# EAGLE design BaseStationV1 (EAGLE 5.07)
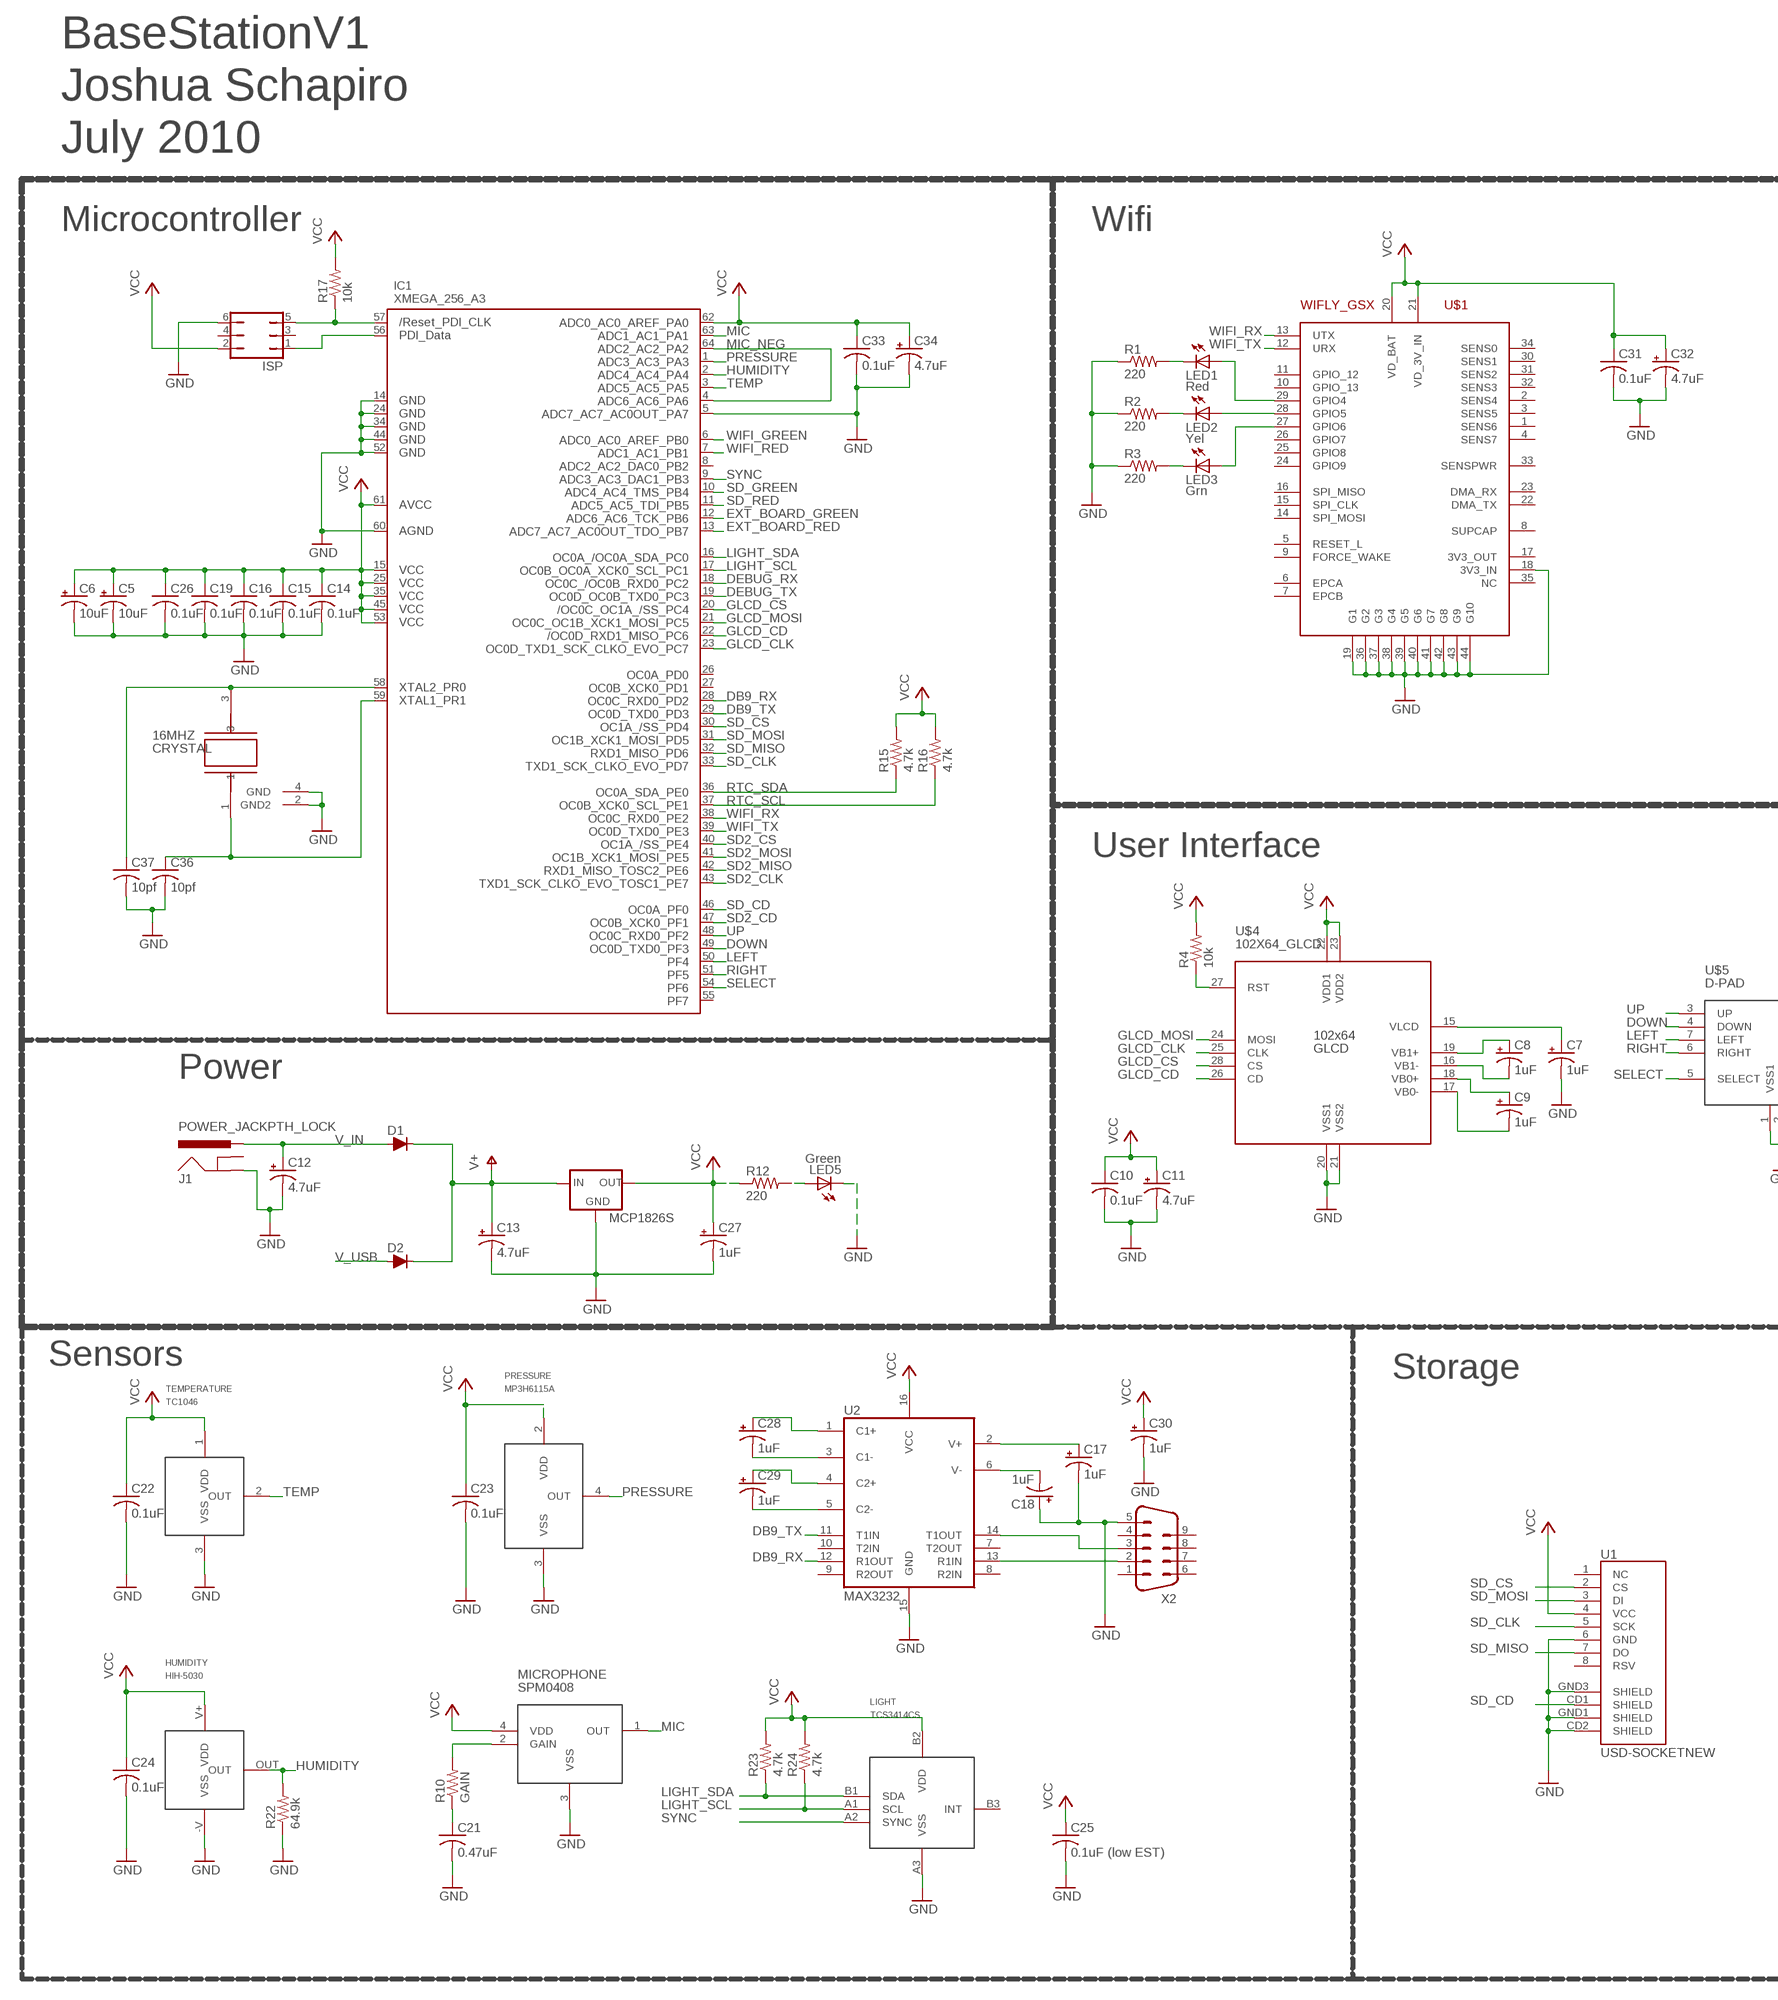
[diagram p0: schematic, sheet 1, part 1 of 2]
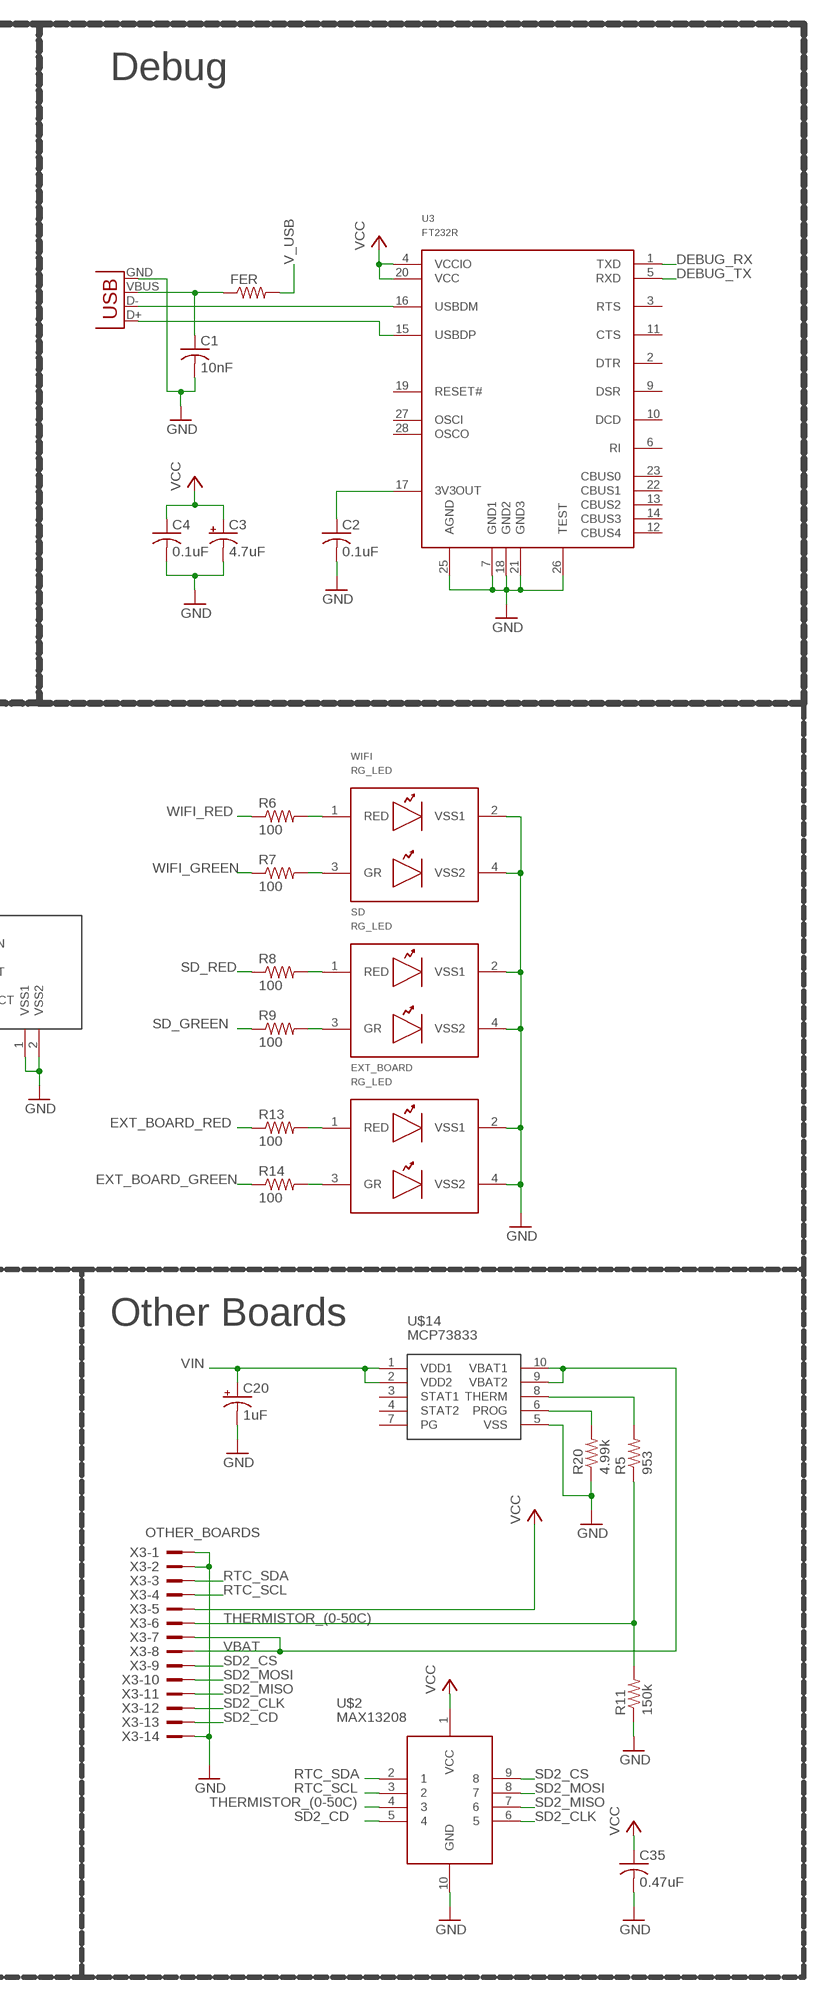
[diagram p1: schematic, sheet 1, part 2 of 2]

## Parts
16MHZ  CRYSTAL  [3.2X2.5MMCRYSTAL]
C1  10nF  C-USC1206  [C1206]
C2  0.1uF  C-USC1206  [C1206]
C3  4.7uF  CPOL-USB  [PANASONIC_B]
C4  0.1uF  C-USC1206  [C1206]
C5  10uF  CPOL-USB  [PANASONIC_B]
C6  10uF  CPOL-USB  [PANASONIC_B]
C7  1uF  CPOL-USB  [PANASONIC_B]
C8  1uF  CPOL-USB  [PANASONIC_B]
C9  1uF  CPOL-USB  [PANASONIC_B]
C10  0.1uF  C-USC1206  [C1206]
C11  4.7uF  CPOL-USB  [PANASONIC_B]
C12  4.7uF  CPOL-USB  [PANASONIC_B]
C13  4.7uF  CPOL-USB  [PANASONIC_B]
C14  0.1uF  C-USC1206  [C1206]
C15  0.1uF  C-USC1206  [C1206]
C16  0.1uF  C-USC1206  [C1206]
C17  1uF  CPOL-USB  [PANASONIC_B]
C18  1uF  CPOL-USB  [PANASONIC_B]
C19  0.1uF  C-USC1206  [C1206]
C20  1uF  CPOL-USB  [PANASONIC_B]
C21  0.47uF  C-USC1206  [C1206]
C22  0.1uF  C-USC1206  [C1206]
C23  0.1uF  C-USC1206  [C1206]
C24  0.1uF  C-USC1206  [C1206]
C25  0.1uF (low EST)  C-USC1206  [C1206]
C26  0.1uF  C-USC1206  [C1206]
C27  1uF  CPOL-USB  [PANASONIC_B]
C28  1uF  CPOL-USB  [PANASONIC_B]
C29  1uF  CPOL-USB  [PANASONIC_B]
C30  1uF  CPOL-USB  [PANASONIC_B]
C31  0.1uF  C-USC1206  [C1206]
C32  4.7uF  CPOL-USB  [PANASONIC_B]
C33  0.1uF  C-USC1206  [C1206]
C34  4.7uF  CPOL-USB  [PANASONIC_B]
C35  0.47uF  C-USC1206  [C1206]
C36  10pf  C-USC1206  [C1206]
C37  10pf  C-USC1206  [C1206]
D1  D-FILL-SMB  [SMB]
D2  D-FILL-SMB  [SMB]
EXT_BOARD  RG_LED  [RG_LED]
FER  R-US_R0805  [R0805]
HUMIDITY  HIH-5030  [HIH-5030]
IC1  XMEGA_256_A3  AVR_XMEGA_A3_  [TQFP64]
ISP  JP3Q  [JP3Q]
J1  POWER_JACKPTH_LOCK  [POWER_JACK_PTH_LOCK]
LED1  Red  LEDCHIPLED_1206  [CHIPLED_1206]
LED2  Yel  LEDCHIPLED_1206  [CHIPLED_1206]
LED3  Grn  LEDCHIPLED_1206  [CHIPLED_1206]
LED5  Green  LEDCHIPLED_1206  [CHIPLED_1206]
LIGHT  TCS3414CS  [2X3BGA]
MCP1826S  78XXL  [78XXL]
MICROPHONE  SPM0408  [SPM0408]
PRESSURE  MP3H6115A  [1317-04]
R1  220  R-US_R1206  [R1206]
R2  220  R-US_R1206  [R1206]
R3  220  R-US_R1206  [R1206]
R4  10k  R-US_R1206  [R1206]
R5  953  R-US_R1206  [R1206]
R6  100  R-US_R1206  [R1206]
R7  100  R-US_R1206  [R1206]
R8  100  R-US_R1206  [R1206]
R9  100  R-US_R1206  [R1206]
R10  GAIN  R-US_R1206  [R1206]
R11  150k  R-US_R1206  [R1206]
R12  220  R-US_R1206  [R1206]
R13  100  R-US_R1206  [R1206]
R14  100  R-US_R1206  [R1206]
R15  4.7k  R-US_R1206  [R1206]
R16  4.7k  R-US_R1206  [R1206]
R17  10k  R-US_R1206  [R1206]
R20  4.99k  R-US_R1206  [R1206]
R22  64.9k  R-US_R1206  [R1206]
R23  4.7k  R-US_R1206  [R1206]
R24  4.7k  R-US_R1206  [R1206]
SD  RG_LED  [RG_LED]
TEMPERATURE  TC1046  [3-PIN_SOT-23B]
U1  USD-SOCKETNEW  [MICRO-SD-SOCKET-PP]
U2  MAX3232  MAX232SOIC16  [SO016]
U3  FT232R  [SSOP28]
U$1  WIFLY_GSX  [WIFLY_GSX]
U$2  MAX13208  [10-UDFN]
U$4  102X64_GLCD  [102X64_GLCD]
U$5  D-PAD  [D-PAD]
U$14  MCP73833  [10-MSOP]
WIFI  RG_LED  [RG_LED]
X1  USBPTH  [USB-B-PTH]
X2  M09-182  [182-009-MALE]
X3  OTHER_BOARDS  2514-  [PAK100/2500-14]

## Nets
DB9_RX: IC1.28(PD2) U2.12(R1OUT)
DB9_TX: IC1.29(PD3) U2.11(T1IN)
DEBUG_RX: IC1.18(PC2) U3.1(TXD)
DEBUG_TX: IC1.19(PC3) U3.5(RXD)
DOWN: IC1.49(PF3) U$5.4(DOWN)
EXT_BOARD_GREEN: IC1.12(PB6) R14.1
EXT_BOARD_RED: IC1.13(PB7) R13.1
GLCD_CD: IC1.22(PC6) U$4.26(CD)
GLCD_CLK: IC1.23(PC7) U$4.25(CLK)
GLCD_CS: IC1.20(PC4) U$4.28(CS)
GLCD_MOSI: IC1.21(PC5) U$4.24(MOSI)
GND: 16MHZ.2(GND2) 16MHZ.4(GND) C1.2 C2.2 C3.- C4.2 C5.- C6.- C7.- C10.2 C11.- C12.- C13.- C14.2 C15.2 C16.2 C17.- C18.+ C19.2 C20.- C21.2 C22.2 C23.2 C24.2 C25.2 C26.2 C27.- C30.- C31.2 C32.- C33.2 C34.- C35.2 C36.2 C37.2 EXT_BOARD.2(VSS1) EXT_BOARD.4(VSS2) HUMIDITY.-V(VSS) IC1.5(PA7) IC1.14(GND1) IC1.24(GND2) IC1.34(GND3) IC1.44(GND4) IC1.52(GND5) IC1.60(AGND) ISP.6 J1.GND LED5.C LIGHT.A3(VSS) MCP1826S.GND MICROPHONE.3(VSS) PRESSURE.3(VSS) R1.1 R2.1 R3.1 R11.1 R20.1 R22.1 SD.2(VSS1) SD.4(VSS2) TEMPERATURE.3(VSS) U1.6(GND) U1.CD2(SHIELD) U1.GND1(SHIELD) U1.GND3(SHIELD) U2.15(GND) U3.7(GND1) U3.18(GND2) U3.21(GND3) U3.25(AGND) U3.26(TEST) U$1.18(3V3_IN) U$1.19(G1) U$1.36(G2) U$1.37(G3) U$1.38(G4) U$1.39(G5) U$1.40(G6) U$1.41(G7) U$1.42(G8) U$1.43(G9) U$1.44(G10) U$2.10(GND) U$4.20(VSS1) U$4.21(VSS2) U$5.1(VSS1) U$5.2(VSS2) U$14.5(VSS) WIFI.2(VSS1) WIFI.4(VSS2) X1.GND X2.5 X3.1 X3.2 X3.14
HUMIDITY: HUMIDITY.OUT IC1.2(PA4) R22.2
LEFT: IC1.50(PF4) U$5.7(LEFT)
LIGHT_SCL: IC1.17(PC1) LIGHT.A1(SCL) R24.1
LIGHT_SDA: IC1.16(PC0) LIGHT.B1(SDA) R23.1
MIC: IC1.63(PA1) MICROPHONE.1(OUT)
MIC_NEG: IC1.4(PA6) IC1.64(PA2)
N$1: IC1.57(RESET) ISP.5 R17.1
N$2: IC1.56(PDI_DATA) ISP.1
N$3: LED2.A U$1.28(GPIO5)
N$4: LED1.A U$1.29(GPIO4)
N$5: LED3.A U$1.27(GPIO6)
N$6: LED1.C R1.2
N$7: LED2.C R2.2
N$8: LED3.C R3.2
N$10: C1.1 FER.1 X1.VBUS
N$12: U3.16(USBDM) X1.D-
N$13: U3.15(USBDP) X1.D+
N$14: C8.+ U$4.19(VB1+)
N$15: C8.- U$4.16(VB1-)
N$16: EXT_BOARD.1(RED) R13.2
N$17: EXT_BOARD.3(GR) R14.2
N$18: C2.1 U3.17(3V3OUT)
N$19: C17.+ U2.2(V+)
N$20: U2.14(T1OUT) X2.3
N$21: C9.+ U$4.18(VB0+)
N$22: C9.- U$4.17(VB0-)
N$23: C7.+ U$4.15(VLCD)
N$24: R4.1 U$4.27(RST)
N$25: R5.2 U$14.8(THERM)
N$26: R8.2 SD.1(RED)
N$27: R6.2 WIFI.1(RED)
N$28: R7.2 WIFI.3(GR)
N$29: U2.13(R1IN) X2.2
N$30: R9.2 SD.3(GR)
N$31: C18.- U2.6(V-)
N$32: C21.1 R10.1
N$33: MICROPHONE.2(GAIN) R10.2
N$37: LED5.A R12.2
N$41: C28.+ U2.1(C1+)
N$42: C28.- U2.3(C1-)
N$43: C29.+ U2.4(C2+)
N$49: C29.- U2.5(C2-)
N$51: R20.2 U$14.6(PROG)
PRESSURE: IC1.1(PA3) PRESSURE.4(OUT)
RIGHT: IC1.51(PF5) U$5.6(RIGHT)
RTC_SCL: IC1.37(PE1) R16.1 U$2.3 X3.4
RTC_SDA: IC1.36(PE0) R15.1 U$2.2 X3.3
SD2_CD: IC1.47(PF1) U$2.5 X3.13
SD2_CLK: IC1.43(PE7) U$2.6 X3.12
SD2_CS: IC1.40(PE4) U$2.9 X3.9
SD2_MISO: IC1.42(PE6) U$2.7 X3.11
SD2_MOSI: IC1.41(PE5) U$2.8 X3.10
SD_CD: IC1.46(PF0) U1.CD1(SHIELD)
SD_CLK: IC1.33(PD7) U1.5(SCK)
SD_CS: IC1.30(PD4) U1.2(CS)
SD_GREEN: IC1.10(PB4) R9.1
SD_MISO: IC1.32(PD6) U1.7(DO)
SD_MOSI: IC1.31(PD5) U1.3(DI)
SD_RED: IC1.11(PB5) R8.1
SELECT: IC1.54(PF6) U$5.5(SELECT)
SYNC: IC1.9(PB3) LIGHT.A2(SYNC)
TEMP: IC1.3(PA5) TEMPERATURE.2(OUT)
THERMISTOR_(0-50C): R5.1 R11.2 U$2.4 X3.6
UP: IC1.48(PF2) U$5.3(UP)
V+: C13.+ D1.1(C) D2.1(C) MCP1826S.IN
V_IN: C12.+ D1.2(A) J1.PWR
V_USB: D2.2(A) FER.2
VBAT: U$14.9(VBAT2) U$14.10(VBAT1) X3.7 X3.8
VCC: C3.+ C4.1 C5.+ C6.+ C10.1 C11.+ C14.1 C15.1 C16.1 C19.1 C22.1 C23.1 C24.1 C25.1 C26.1 C27.+ C30.+ C31.1 C32.+ C33.1 C34.+ C35.1 HUMIDITY.V+(VDD) IC1.15(VCC1) IC1.25(VCC2) IC1.35(VCC3) IC1.45(VCC4) IC1.53(VCC5) IC1.61(AVCC) IC1.62(PA0) ISP.2 LIGHT.B2(VDD) MCP1826S.OUT MICROPHONE.4(VDD) PRESSURE.2(VDD) R4.2 R12.1 R15.2 R16.2 R17.2 R23.2 R24.2 TEMPERATURE.1(VDD) U1.4(VCC) U2.16(VCC) U3.4(VCCIO) U3.20(VCC) U$1.20(VD_BAT) U$1.21(VD_3V_IN) U$2.1(VCC) U$4.22(VDD1) U$4.23(VDD2) X3.5
VIN: C20.+ U$14.1(VDD1) U$14.2(VDD2)
WIFI_GREEN: IC1.6(PB0) R7.1
WIFI_RED: IC1.7(PB1) R6.1
WIFI_RX: IC1.38(PE2) U$1.13(UTX)
WIFI_TX: IC1.39(PE3) U$1.12(URX)
X1: 16MHZ.1 C36.1 IC1.59(PR1)
X2: 16MHZ.3 C37.1 IC1.58(PR0)
Unconnected: IC1.8(PB2) IC1.26(PD0) IC1.27(PD1) IC1.55(PF7) ISP.3 ISP.4 J1.GNDBREAK LIGHT.B3(INT) U1.1(NC) U1.8(RSV) U2.7(T2OUT) U2.8(R2IN) U2.9(R2OUT) U2.10(T2IN) U3.2(DTR) U3.3(RTS) U3.6(RI) U3.9(DSR) U3.10(DCD) U3.11(CTS) U3.12(CBUS4) U3.13(CBUS2) U3.14(CBUS3) U3.19(RESET#) U3.22(CBUS1) U3.23(CBUS0) U3.27(OSCI) U3.28(OSCO) U$1.1(SENS6) U$1.2(SENS4) U$1.3(SENS5) U$1.4(SENS7) U$1.5(RESET_L) U$1.6(EPCA) U$1.7(EPCB) U$1.8(SUPCAP) U$1.9(FORCE_WAKE) U$1.10(GPIO_13) U$1.11(GPIO_12) U$1.14(SPI_MOSI) U$1.15(SPI_CLK) U$1.16(SPI_MISO) U$1.17(3V3_OUT) U$1.22(DMA_TX) U$1.23(DMA_RX) U$1.24(GPIO9) U$1.25(GPIO8) U$1.26(GPIO7) U$1.30(SENS1) U$1.31(SENS2) U$1.32(SENS3) U$1.33(SENSPWR) U$1.34(SENS0) U$1.35(NC) U$14.3(STAT1) U$14.4(STAT2) U$14.7(PG) X2.1 X2.4 X2.6 X2.7 X2.8 X2.9

## Notes on the sheet
- BaseStationV1
- Joshua Schapiro
- July 2010
- Microcontroller | Wifi | Debug
- User Interface
- Power
- Sensors
- Storage | Other Boards

## Library data of the parts
16MHZ = Josh:CRYSTAL
C1 C2 C4 C10 C14-C16 C19 C21-C26 C31 C33 C35-C37 = resistor:C-US: CAPACITOR, American symbol
C3 C5 C6 C11-C13 C32 C34 = gadgetry:CPOL-US: POLARIZED CAPACITOR, American symbol
C7-C9 C17 C18 C20 C27-C30 = resistor:CPOL-US: POLARIZED CAPACITOR, American symbol
D1 D2 = semicon-smd-ipc:D-FILL-: DIODE filled
EXT_BOARD SD WIFI = Josh:RG_LED
FER R1-R17 R20 R22-R24 = resistor:R-US_: RESISTOR, American symbol
HUMIDITY = Josh:HIH-5030
IC1 = xmega:AVR_XMEGA_A3_: Device for Atmel AVR XMEGA A3 Series
ISP = jumper:JP3Q: JUMPER
J1 = SparkFun:POWER_JACK: Power Jack This is the standard 5.5mm barrel jack for power. The PTH is the most common, proven, reliable, footprint. All others are experimental. The Slot footprint only works if the mill layer is transmitted to the PCB fab house so be warned. Spark Fun Electronics SKU : PRT-00119. Mating wall wart : TOL-00298 (and others)
LED1-LED3 LED5 = led:LED: LED OSRAM: - CHIPLED LG R971, LG N971, LY N971, LG Q971, LY Q971, LO R971, LY R971 LH N974, LH R974 LS Q976, LO Q976, LY Q976 LO Q996 - Hyper CHIPLED LW Q18S LB Q993, LB Q99A, LB R99A - SideLED LS A670, LO A670, LY A670, LG A670, LP A670 LB A673, LV A673, LT A673, LW A673 LH A674 LY A675 LS A676, LA A676, LO A676, LY A676, LW A676 LS A679, LY A679, LG A679 - Hyper Micro SIDELED® LS Y876, LA Y876, LO Y876, LY Y876 LT Y87S - SmartLED LW L88C, LW L88S LB L89C, LB L89S, LG L890 LS L89K, LO L89K, LY L89K LS L896, LA L896, LO L896, LY L896 - TOPLED LS T670, LO T670, LY T670, LG T670, LP T670 LSG T670, LSP T670, LSY T670, LOP T670, LYG T670 LG T671, LOG T671, LSG T671 LB T673, LV T673, LT T673, LW T673 LH T674 LS T676, LA T676, LO T676, LY T676, LB T676, LH T676, LSB T676, LW T676 LB T67C, LV T67C, LT T67C, LS T67K, LO T67K, LY T67K, LW E67C LS E67B, LA E67B, LO E67B, LY E67B, LB E67C, LV E67C, LT E67C LW T67C LS T679, LY T679, LG T679 LS T770, LO T770, LY T770, LG T770, LP T770 LB T773, LV T773, LT T773, LW T773 LH T774 LS E675, LA E675, LY E675, LS T675 LS T776, LA T776, LO T776, LY T776, LB T776 LHGB T686 LT T68C, LB T68C - Hyper Mini TOPLED® LB M676 - Mini TOPLED Santana® LG M470 LS M47K, LO M47K, LY M47K Source: http://www.osram.convergy.de - LUMILED® LXK2-PW12-R00, LXK2-PW12-S00, LXK2-PW14-U00, LXK2-PW14-V00 LXK2-PM12-R00, LXK2-PM12-S00, LXK2-PM14-U00 LXK2-PE12-Q00, LXK2-PE12-R00, LXK2-PE12-S00, LXK2-PE14-T00, LXK2-PE14-U00 LXK2-PB12-K00, LXK2-PB12-L00, LXK2-PB12-M00, LXK2-PB14-N00, LXK2-PB14-P00, LXK2-PB14-Q00 LXK2-PR12-L00, LXK2-PR12-M00, LXK2-PR14-Q00, LXK2-PR14-R00 LXK2-PD12-Q00, LXK2-PD12-R00, LXK2-PD12-S00 LXK2-PH12-R00, LXK2-PH12-S00 LXK2-PL12-P00, LXK2-PL12-Q00, LXK2-PL12-R00 Source: www.luxeon.com
LIGHT = Josh:TCS3414CS
MCP1826S = v-reg:78XXL: VOLTAGE REGULATOR
MICROPHONE = Josh:SPM0408
PRESSURE = Josh:MP3H6115A
TEMPERATURE = Josh:TC1046
U1 = SparkFun:USD-SOCKET: microSD Socket Push-push type uSD socket. Schematic element and footprint production proven. Spark Fun Electronics SKU : PRT-00127. tDoc lines correctly indicate media card edge positions when inserting (unlocked, locked, depressed).
U2 = SparkFun:MAX232: RS232 Transceiver Very common IC. This is generically called 'MAX232', but works with the 3V equivalent MAX3232 generic ICs. Field tested and mother approved. Spark Fun Electronics SKU : COM-00316 (DIP) and COM-00589 (SMD)
U3 = gadgetry:FT232R
U$1 = SparkFun:WIFLY_GSX
U$2 = Josh:MAX13208
U$4 = Josh:102X64_GLCD
U$5 = Josh:D-PAD
U$14 = Josh:MCP73833
X1 = SparkFun:USB: USB Connectors USB-B-PTH is fully proven SKU : PRT-00139 USB-miniB is fully proven SKU : PRT-00587 USB-A-PCB is untested. USB-A-H is throughly reviewed, but untested. Spark Fun Electronics SKU : PRT-00437 USB-B-SMT is throughly reviewed, but untested. Needs silkscreen touching up. USB-A-S has not been used/tested USB-MB-H has not been used/tested
X2 = con-subd:M09: SUB-D
X3 = con-3m:2514-: 3M (TM) Pak 100 4-Wall Header Source: 3M

## Board
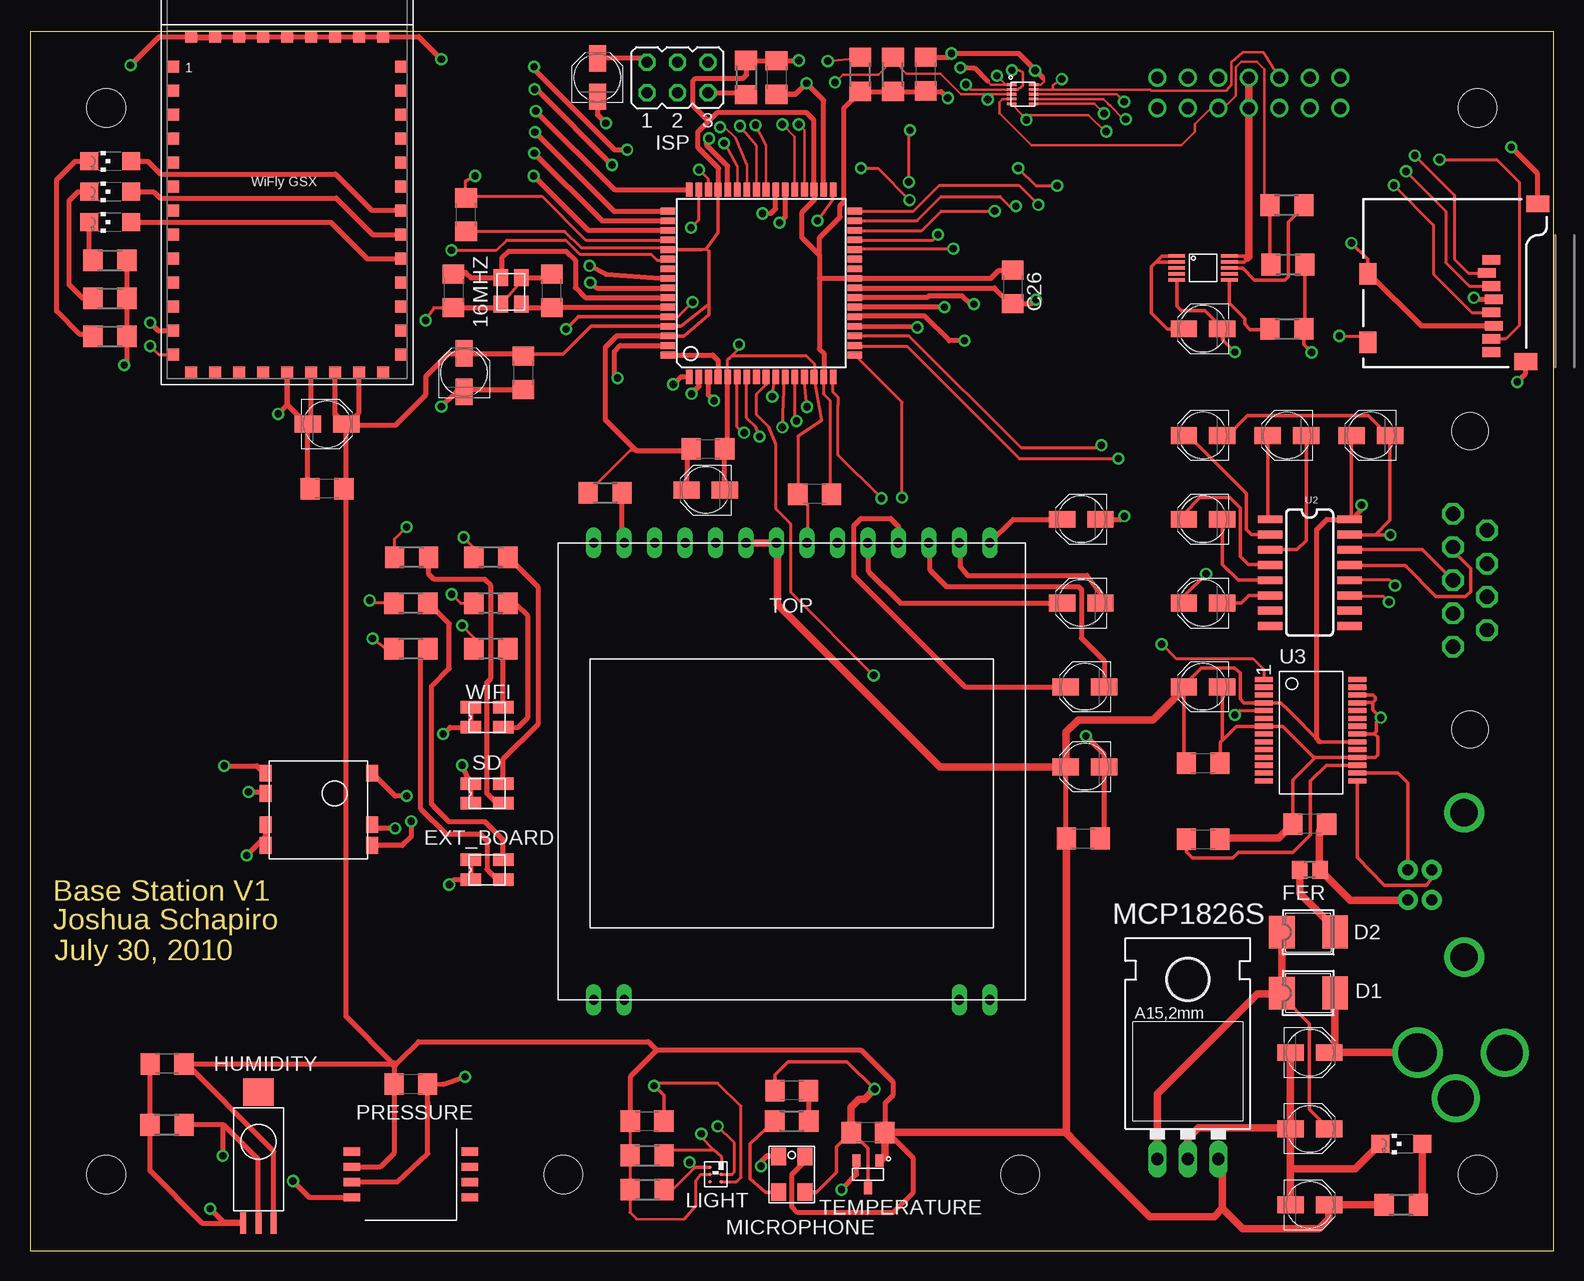
[diagram p2: board, top side]
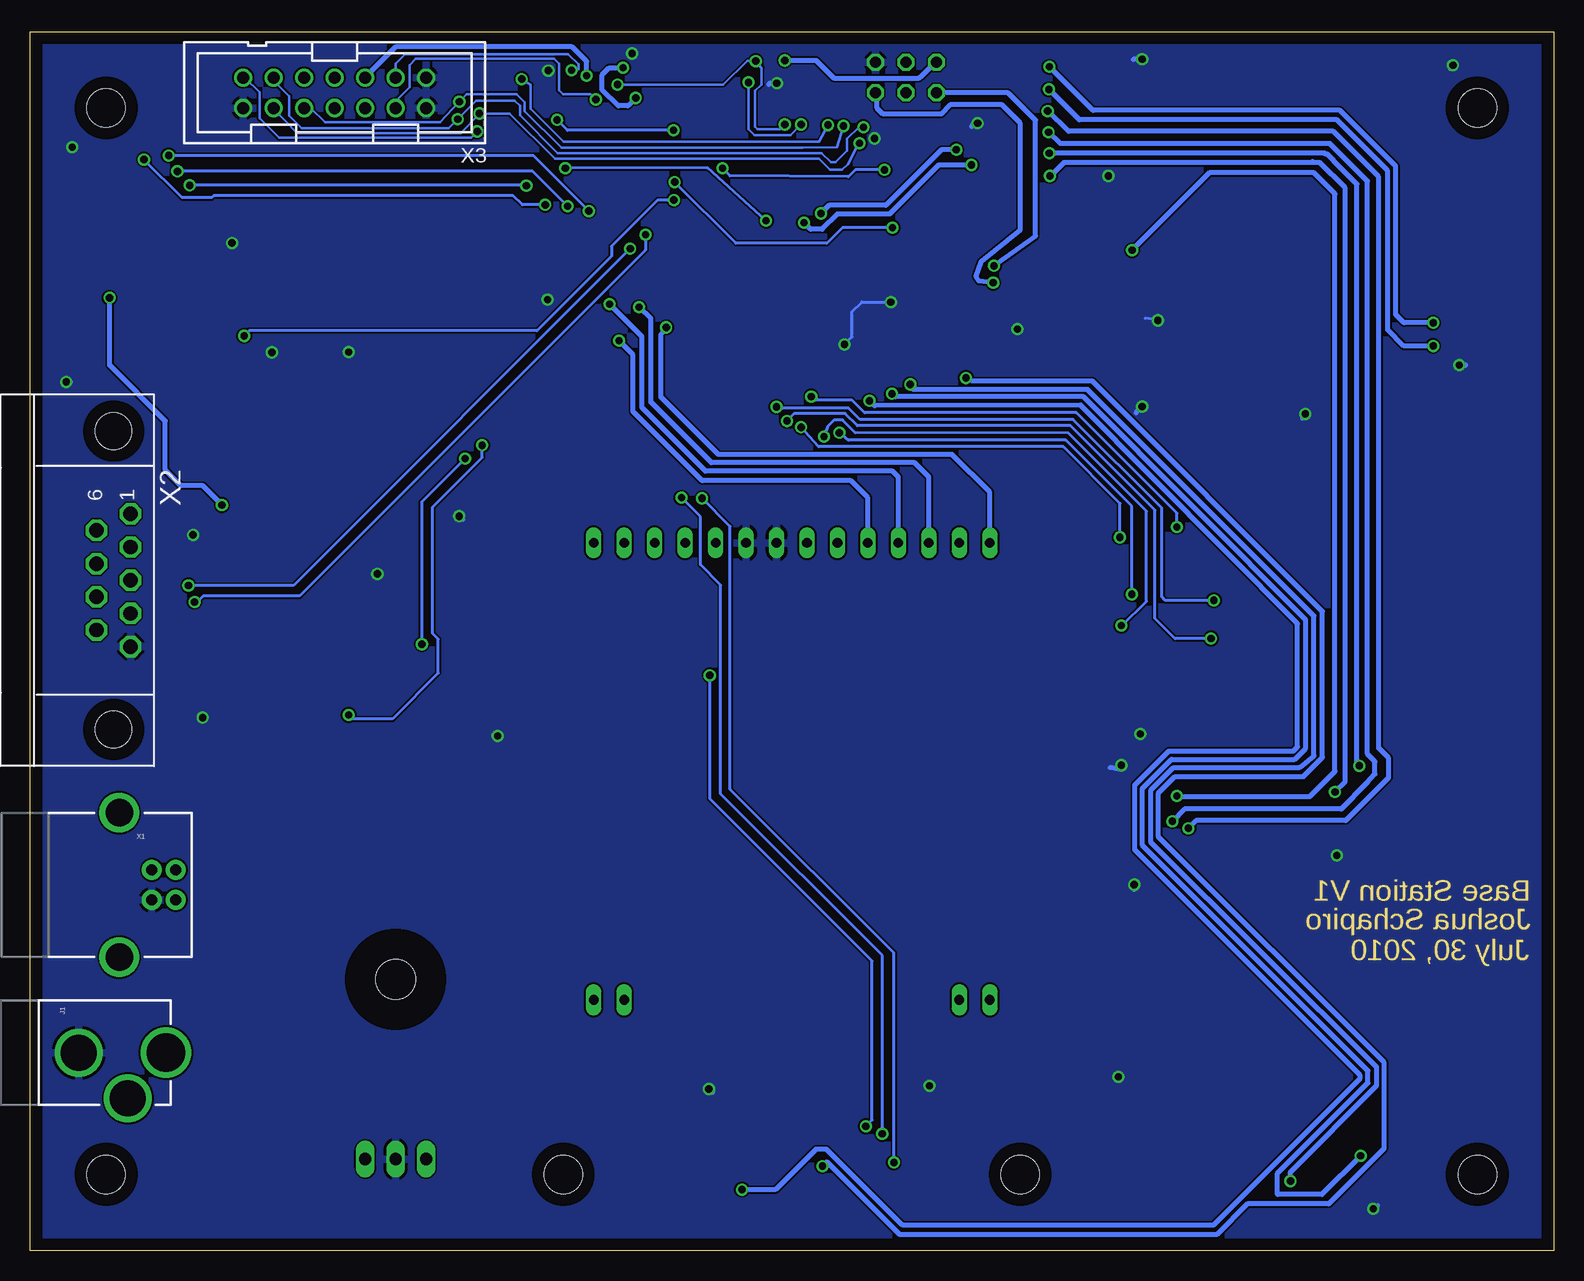
[diagram p3: board, bottom side, seen from below]

Size 127 x 101.6 mm. Coordinates in mm from the lower left corner, seen from the top.
Outline: 0,0 127,0 127,101.6 0,101.6 0,0
Copper layers (1*16): Top 0.035mm / dielectric 1.5mm / Bottom 0.035mm
Design rules "default *": minimum track width 6mil, minimum drill 15mil, track to track 6mil, track to pad 6mil, pad to pad 6mil, via to via 6mil, smd to smd 6mil, copper to edge 40mil, drill to drill 8mil, minimum pad ring 10mil, minimum via ring 8mil, stop-mask expansion 4mil, vias tented up to drill 0mil, thermal gap 10mil
Holes 3.2 mm at 6.35,6.35 120.65,6.35 6.35,95.25 120.65,95.25 82.55,6.35 44.45,6.35

### Footprints (pad centres in the part's own frame; a part is rotated, then mirrored left to right if it is on the bottom)
3.2X2.5MMCRYSTAL = smd 1.397 x 1.194: 1 0,0; 2 2.2,0; 3 2.2,1.702; 4 0,1.702
C1206 = smd 1.6 x 1.8: 1 -1.4,0; 2 1.4,0
PANASONIC_B = smd 2.2 x 1.4: + 1.6,0; - -1.6,0
SMB = smd 2.159 x 2.743: 1 -2.311,-0.127; 2 2.108,-0.102
RG_LED = smd 1.699 x 1.041: 1 1.35,0.825; 2 -1.35,0.825; 3 1.35,-0.825; 4 -1.35,-0.825
R0805 = smd 1.3 x 1.5: 1 -0.85,0; 2 0.85,0
HIH-5030 = smd 0.508 x 1.778: -V -1.27,-5.334; OUT 0,-5.334; V+ 1.27,-5.334 | smd 2.54 x 2.286: NC 0,5.588
TQFP64 = smd 1.194 x 0.559: 1 -7.8,6; 2 -7.8,5.2; 3 -7.8,4.4; 4 -7.8,3.6; 5 -7.8,2.8; 6 -7.8,2; 7 -7.8,1.2; 8 -7.8,0.4; 9 -7.8,-0.4; 10 -7.8,-1.2; 11 -7.8,-2; 12 -7.8,-2.8; 13 -7.8,-3.6; 14 -7.8,-4.4; 15 -7.8,-5.2; 16 -7.8,-6; 33 7.8,-6; 34 7.8,-5.2; 35 7.8,-4.4; 36 7.8,-3.6; 37 7.8,-2.8; 38 7.8,-2; 39 7.8,-1.2; 40 7.8,-0.4; 41 7.8,0.4; 42 7.8,1.2; 43 7.8,2; 44 7.8,2.8; 45 7.8,3.6; 46 7.8,4.4; 47 7.8,5.2; 48 7.8,6 | smd 0.559 x 1.194: 17 -6,-7.8; 18 -5.2,-7.8; 19 -4.4,-7.8; 20 -3.6,-7.8; 21 -2.8,-7.8; 22 -2,-7.8; 23 -1.2,-7.8; 24 -0.4,-7.8; 25 0.4,-7.8; 26 1.2,-7.8; 27 2,-7.8; 28 2.8,-7.8; 29 3.6,-7.8; 30 4.4,-7.8; 31 5.2,-7.8; 32 6,-7.8; 49 6,7.8; 50 5.2,7.8; 51 4.4,7.8; 52 3.6,7.8; 53 2.8,7.8; 54 2,7.8; 55 1.2,7.8; 56 0.4,7.8; 57 -0.4,7.8; 58 -1.2,7.8; 59 -2,7.8; 60 -2.8,7.8; 61 -3.6,7.8; 62 -4.4,7.8; 63 -5.2,7.8; 64 -6,7.8
JP3Q = drill 0.914 octagon: 1 -2.54,-1.27; 2 -2.54,1.27; 3 0,-1.27; 4 0,1.27; 5 2.54,-1.27; 6 2.54,1.27
POWER_JACK_PTH_LOCK = drill 2.997 round: GND 0.025,6.608; GNDBREAK 3.812,10.7 | drill 3.2 round: PWR 0,13.878
CHIPLED_1206 = smd 1.5 x 1.5: A 0,-1.75; C 0,1.75
2X3BGA = smd 0.3 x 0.3: A1 -0.61,0.475; A2 0,0.475; A3 0.61,0.475; B1 -0.61,-0.475; B2 0,-0.475; B3 0.61,-0.475
78XXL = drill 1.016 long: GND 0,-3.81; IN -2.54,-3.81; OUT 2.54,-3.81 | hole 3.302: 0,11.176
SPM0408 = smd 1.245 x 1.448: 1 -1.105,1.486; 2 -1.105,-1.486; 3 1.105,-1.486; 4 1.105,1.486
1317-04 = smd 1.346 x 0.686: 1 -4.915,1.905; 2 -4.915,0.635; 3 -4.915,-0.635; 4 -4.915,-1.905; 5 4.915,-1.905; 6 4.915,-0.635; 7 4.915,0.635; 8 4.915,1.905
R1206 = smd 1.6 x 1.803: 1 -1.422,0; 2 1.422,0
3-PIN_SOT-23B = smd 0.65 x 1.05: 1 -0.95,-1.15; 2 0.95,-1.15; 3 0,1.15
MICRO-SD-SOCKET-PP = smd 0.8 x 1.5: 1 -8.94,10.7; 2 -7.84,10.3; 3 -6.74,10.7; 4 -5.64,10.9; 5 -4.54,10.7; 6 -3.44,10.9; 7 -2.34,10.7; 8 -1.24,10.7 | smd 1.8 x 1.4: CD1 -2.05,0.4; CD2 -7.75,0.4 | smd 1.4 x 1.9: GND1 -13.6,14.55; GND3 -0.45,13.55
SO016 = smd 0.66 x 2.032: 1 -4.445,-3.315; 2 -3.175,-3.315; 3 -1.905,-3.315; 4 -0.635,-3.315; 5 0.635,-3.315; 6 1.905,-3.315; 7 3.175,-3.315; 8 4.445,-3.315; 9 4.445,3.315; 10 3.175,3.315; 11 1.905,3.315; 12 0.635,3.315; 13 -0.635,3.315; 14 -1.905,3.315; 15 -3.175,3.315; 16 -4.445,3.315
SSOP28 = smd 0.425 x 1.5: 1 0.65,-1.3; 2 1.3,-1.3; 3 1.95,-1.3; 4 2.6,-1.3; 5 3.25,-1.3; 6 3.9,-1.3; 7 4.55,-1.3; 8 5.2,-1.3; 9 5.85,-1.3; 10 6.5,-1.3; 11 7.15,-1.3; 12 7.8,-1.3; 13 8.45,-1.3; 14 9.1,-1.3; 15 9.1,6.5; 16 8.45,6.5; 17 7.8,6.5; 18 7.15,6.5; 19 6.5,6.5; 20 5.85,6.5; 21 5.2,6.5; 22 4.55,6.5; 23 3.9,6.5; 24 3.25,6.5; 25 2.6,6.5; 26 1.95,6.5; 27 1.3,6.5; 28 0.65,6.5
WIFLY_GSX = smd 1 x 1: 1 0.5,26; 2 0.5,24; 3 0.5,22; 4 0.5,20; 5 0.5,18; 6 0.5,16; 7 0.5,14; 8 0.5,12; 9 0.5,10; 10 0.5,8; 11 0.5,6; 12 0.5,4; 13 0.5,2; 14 2,0.5; 15 4,0.5; 16 6,0.5; 17 8,0.5; 18 10,0.5; 19 12,0.5; 20 14,0.5; 21 16,0.5; 22 18,0.5; 23 19.5,2; 24 19.5,4; 25 19.5,6; 26 19.5,8; 27 19.5,10; 28 19.5,12; 29 19.5,14; 30 19.5,16; 31 19.5,18; 32 19.5,20; 33 19.5,22; 34 19.5,24; 35 19.5,26; 36 18,28.5; 37 16,28.5; 38 14,28.5; 39 12,28.5; 40 10,28.5; 41 8,28.5; 42 6,28.5; 43 4,28.5; 44 2,28.5
10-UDFN = smd 0.8 x 0.22: 1 -0.91,0.8; 2 -0.91,0.4; 3 -0.91,0; 4 -0.91,-0.4; 5 -0.91,-0.8; 6 0.91,-0.8; 7 0.91,-0.4; 8 0.91,0; 9 0.91,0.4; 10 0.91,0.8
102X64_GLCD = drill 0.8 long: 1 -16.51,-17.2; 2 -13.97,-17.2; 13 13.97,-17.2; 14 16.51,-17.2; 15 16.51,20.9; 16 13.97,20.9; 17 11.43,20.9; 18 8.89,20.9; 19 6.35,20.9; 20 3.81,20.9; 21 1.27,20.9; 22 -1.27,20.9; 23 -3.81,20.9; 24 -6.35,20.9; 25 -8.89,20.9; 26 -11.43,20.9; 27 -13.97,20.9; 28 -16.51,20.9
D-PAD = smd 0.998 x 1.397: 1 -5.757,-4.318; 2 -5.757,-2.591; 3 3.141,-2.591; 4 3.141,-4.318; 5 3.141,1.702; 6 -5.757,0; 7 -5.757,1.702
10-MSOP = smd 0.3 x 1.4: 1 -1,-2.2; 2 -0.5,-2.2; 3 0,-2.2; 4 0.5,-2.2; 5 1,-2.2; 6 1,2.2; 7 0.5,2.2; 8 0,2.2; 9 -0.5,2.2; 10 -1,2.2
USB-B-PTH = drill 0.914 pad 1.676 round: D+ 0,1.25; D- 1.981,1.25; GND 0,-1.25; VBUS 1.981,-1.25 | drill 2.286 round: P$1 -2.718,-6.02; P$2 -2.718,6.02
182-009-MALE = drill 1.194 pad 1.524 octagon: 1 -5.537,10.923; 2 -2.769,10.923; 3 0,10.923; 4 2.769,10.923; 5 5.537,10.923; 6 -4.153,8.08; 7 -1.384,8.08; 8 1.384,8.08; 9 4.153,8.08 | hole 3.048: -12.446,9.501; 12.446,9.501
PAK100/2500-14 = drill 1 pad 1.422 round: 1 -7.62,-1.27; 2 -7.62,1.27; 3 -5.08,-1.27; 4 -5.08,1.27; 5 -2.54,-1.27; 6 -2.54,1.27; 7 0,-1.27; 8 0,1.27; 9 2.54,-1.27; 10 2.54,1.27; 11 5.08,-1.27; 12 5.08,1.27; 13 7.62,-1.27; 14 7.62,1.27

### Placement (x,y rotation side)
16MHZ  40.96,78.9 90 top
C1  106.68,35.56 180 top
C2  97.79,34.29 0 top
C3  97.79,46.99 180 top
C4  97.79,40.64 0 top
C5  36.2,73.18 90 top
C6  47.31,97.79 90 top
C7  87.63,60.96 180 top
C8  87.63,53.98 180 top
C9  87.95,46.99 180 top
C10  87.81,34.35 0 top
C11  87.95,40.32 180 top
C12  106.68,16.51 0 top
C13  106.68,10.16 0 top
C14  65.41,63.06 180 top
C15  41.11,73.17 270 top
C16  36.35,86.36 90 top
C17  97.79,67.94 180 top
C18  97.79,53.98 180 top
C19  62.23,97.78 270 top
C20  97.79,76.83 180 top
C21  63.5,13.34 180 top
C22  69.85,9.84 180 top
C23  31.75,13.89 0 top
C24  11.43,15.56 180 top
C25  51.44,10.79 0 top
C26  81.92,80.33 270 top
C27  106.68,3.81 0 top
C28  104.78,67.94 180 top
C29  97.79,60.96 180 top
C30  111.76,67.94 180 top
C31  24.77,63.5 180 top
C32  24.77,68.9 0 top
C33  56.52,66.83 0 top
C34  56.33,63.39 180 top
C35  74.68,98.07 90 top
C36  43.5,80.01 90 top
C37  35.31,80.01 270 top
D1  106.68,21.59 0 top
D2  106.68,26.67 0 top
EXT_BOARD  38.1,31.75 0 top
FER  106.68,31.75 180 top
HUMIDITY  19.05,7.62 0 top
IC1  60.96,80.64 90 top
ISP  53.98,97.79 0 top
J1  129.54,16.51 270 bottom
LED1  6.67,90.81 90 top
LED2  6.67,88.27 90 top
LED3  6.67,85.72 90 top
LED5  114.3,8.89 90 top
LIGHT  57.15,6.35 270 top
MCP1826S  96.52,11.43 0 top
MICROPHONE  63.5,6.35 0 top
PRESSURE  31.75,6.35 0 top
R1  6.67,76.2 180 top
R2  6.67,79.38 180 top
R3  6.67,82.55 180 top
R4  47.94,63.18 180 top
R5  104.78,87.15 0 top
R6  38.42,50.16 0 top
R7  38.42,53.98 0 top
R8  38.42,57.78 0 top
R9  31.81,57.78 0 top
R10  63.5,10.79 180 top
R11  104.85,82.19 180 top
R12  114.3,3.81 0 top
R13  31.75,53.98 0 top
R14  31.75,50.16 0 top
R15  69.2,98.06 270 top
R16  71.93,98.06 270 top
R17  59.69,97.79 90 top
R20  104.78,76.83 180 top
R22  11.43,10.48 0 top
R23  51.44,5.08 180 top
R24  51.44,7.94 180 top
SD  38.1,38.1 0 top
TEMPERATURE  69.85,6.35 180 top
U1  111.12,73.66 270 top
U2  106.68,56.52 270 top
U3  104.14,48.26 270 top
U$1  11.43,72.71 0 top
U$2  82.75,96.39 0 top
U$4  63.5,38.1 0 top
U$5  25.4,38.1 0 top
U$14  97.79,81.92 270 top
WIFI  38.1,44.45 0 top
X1  116.84,30.48 0 bottom
X2  129.54,55.88 270 bottom
X3  101.6,96.52 180 bottom

### Tracks (layer width: path | path; a pad name or v marks a point on that pad's centre or on a via)
DB9_RX  (via drill 0.6)
  Top 0.254: U2.12 113.36,55.88 v113.79,55.45 | 68.64,83.44 68.58,83.39 | IC1.28 68.64,83.44 | v76.96,83.52 68.71,83.52 68.64,83.44
  Bottom 0.254: v113.79,55.45 105.03,55.45 v76.96,83.52
DB9_TX  (via drill 0.6)
  Top 0.254: IC1.29 75.25,84.25 v75.69,84.68 | 109.89,54.51 109.86,54.51 | 109.89,54.51 U2.11 | v113.28,54.08 112.85,54.51 109.89,54.51
  Bottom 0.254: v75.69,84.68 75.69,83.41 104.52,54.59 112.55,54.59 113.06,54.08 v113.28,54.08
DEBUG_RX  (via drill 0.6)
  Top 0.254: U3.1 102.84,48.44 101.93,49.35 95.53,49.35 v94.34,50.55 | v90.73,66.02 82.47,66.02 73.1,75.39 68.91,75.39 68.85,75.44 IC1.18
  Bottom 0.254: v94.34,50.55 94.34,62.41 v90.73,66.02
DEBUG_TX  (via drill 0.6)
  Top 0.254: IC1.19 73.28,76.25 82.65,66.88 89.05,66.88 v89.31,67.13 | U3.5 102.82,45.03 100.81,45.03 v100.43,44.65
  Bottom 0.254: v89.31,67.13 89.31,66.12 93.45,61.98 93.45,51.46 92.96,50.98 92.96,48.13 96.77,44.32 100.1,44.32 v100.43,44.65
DOWN  (via drill 0.6)
  Top 0.406: IC1.49 48.69,86.64 v42.09,93.24 | v31.77,35.79 31.77,34.49 31.04,33.76 28.57,33.76 U$5.4
  Bottom 0.406: v42.09,93.24 41.12,92.28 18.64,92.28 15.52,89.15 15.52,41.4 14.88,40.77 14.88,39.73 15.54,38.96 17.7,36.8 30.76,36.8 v31.77,35.79
EXT_BOARD_GREEN  (via drill 0.6)
  Top 0.254: R14.1 29.72,50.16 v28.55,51.03 | v63.91,69.16 63.91,69.44 63.75,69.6 63.75,72.69 63.83,72.77 IC1.12
  Bottom 0.254: v28.55,51.03 31.55,51 33.22,52.68 33.22,61.72 40.26,68.76 58.04,68.76 59.05,69.77 63.3,69.77 v63.91,69.16
EXT_BOARD_RED  (via drill 0.6)
  Top 0.254: R13.1 28.55,53.98 v28.32,54.2 | 64.59,72.84 64.59,72.85 | 64.59,72.84 IC1.13 | v64.77,70.33 64.54,72.8 64.59,72.84
  Bottom 0.254: v28.32,54.2 32.38,54.2 32.66,54.48 32.66,61.9 40.06,69.29 57.81,69.29 58.75,70.23 64.24,70.23 v64.77,70.33
GLCD_CD  (via drill 0.6)
  Top 0.406: IC1.22 68.73,78.64 | IC1.22 | v76.22,78.64 IC1.22
  Bottom 0.406: U$4.26 52.07,64.49 53.26,65.68 70.21,65.68 75.23,70.71 75.23,77.7 v76.22,78.64
GLCD_CLK  (via drill 0.6)
  Top 0.406: v78.69,78.89 78.38,78.89 77.7,79.58 74.93,79.58 74.8,79.45 68.89,79.45 68.86,79.48 68.83,79.44 IC1.23
  Bottom 0.406: U$4.25 54.61,64.49 55.09,64.97 70.69,64.97 76,70.28 76,76.2 v78.69,78.89
GLCD_CS  (via drill 0.6)
  Top 0.406: IC1.20 68.73,77.01 v73.97,76.96
  Bottom 0.406: U$4.28 46.99,63.22 50.14,66.37 69.62,66.37 74.4,71.14 74.4,76.35 v73.97,76.96
GLCD_MOSI  (via drill 0.6)
  Top 0.406: v77.9,75.84 76.63,75.84 74.57,77.9 68.99,77.9 68.93,77.84 IC1.21
  Bottom 0.406: U$4.24 57.15,62.76 58.57,64.19 70.97,64.19 76.73,69.95 76.73,74.68 v77.9,75.84
GND  (via drill 0.6)
  Top 0.203: U$2.10 84.29,97.19 84.53,97.43 | 84.53,97.43 84.53,97.66 84.43,97.77 | 84.53,97.43 84.53,97.64 v83.8,98.37
  Top 0.254: LIGHT.A3 58.88,5.74 59.28,6.1 59.28,12.04 57.33,13.95 52.22,13.92 52.05,13.74 v52.02,13.74 | C25.2 52.91,10.79 52.98,10.72 | 16MHZ.2 40.96,80.83 39.37,78.99 | C37.2 33.68,78.61 v32.97,77.55 | IC1.52 46.31,84.25 42.67,87.88 36.83,87.88 36.58,87.63 36.45,87.76 C16.2 36.3,89.16 v37.11,89.59 | IC1.5 58.16,74.26 58.31,74.41 | 58.31,74.41 58.52,74.62 64.67,74.62 65.38,73.91 65.38,72.85 65.38,72.84 | 65.38,72.84 65.43,72.8 | 65.38,72.84 IC1.14 65.36,72.74 65.38,72.72 65.35,72.69 65.96,69.19 64,67.89 C14.2 64.82,62.24 64.82,59 U$4.21 | IC1.60 54.02,77.84 v55.24,79.07 | 58.31,74.41 58.32,74.4 59.11,75.18 v59.11,75.54
  Top 0.305: C1.2 105.28,39.24 107.14,41.1 | 107.14,41.1 110.69,41.1 110.68,41.11 U3.18 112.13,41.11 112.34,41.33 112.34,42.8 112.08,43.06 112.02,43.06 | 99.29,42.42 99.21,42.34 99.21,40.72 99.14,40.64 C4.2 | 99.29,42.42 100.58,43.71 U3.7 102.79,43.71 102.77,43.69 104.42,43.69 107.01,41.1 107.14,41.1 | 99.29,42.42 99.26,42.44 99.39,42.57 C3.- | U3.26 111.93,46.31 112.14,46.1 112.14,45.9 111.94,45.7 | U3.25 110.62,45.64 | U3.25 | 111.94,45.7 110.67,45.7 U3.25 | 112.02,43.06 U3.21 | 112.02,43.06 112.24,43.28 112.24,44.07 v112.6,44.42 111.94,45.09 111.94,45.7 | 112.14,59.66 113.36,60.88 C30.- 113.23,67.94 111.58,69.6 101.5,69.6 99.85,67.94 C17.- | U2.15 110.01,59.69 110.03,59.72 110.08,59.66 112.14,59.66 | C18.+ 96.19,54.56 v98.04,56.41 | 112.14,59.66 v113.41,59.66 | TEMPERATURE.3 69.85,8.53 68.54,9.84 C22.2 68.42,9.84 67.21,8.64 67.21,6.53 65.55,4.86 MICROPHONE.3 | C21.2 62.1,14.65 63.2,15.75 68.12,15.75 v70.41,13.46 | C25.2 52.84,12.93 v52.02,13.74 | 45.55,77.69 v44.68,76.81 | 45.55,77.69 45.71,77.84 | 45.55,77.69 45.54,77.7 45.69,77.84 IC1.60 | U$14.5 95.59,78.73 95.96,78.36 97.92,78.36 99.39,76.89 C20.- 99.39,75.95 v100.43,74.91 | v106.83,74.88 106.2,75.52 R20.1 106.25,76.83 106.3,76.89 106.27,76.91 R11.1 | U1.CD2 111.53,82.63 v110.16,84
  Top 0.406: C7.- 90.98,60.96 v91.24,61.21 | C10.2 89.19,34.35 89.18,34.37 89.55,34.73 C11.- 89.55,41.36 v88.01,42.9 | v36.27,14.48 34.42,13.87 C23.2 33.15,12.37 33.15,12.22 33.15,8.1 30.61,5.71 PRESSURE.3 | 10.15,10.48 10.24,10.39 | 10.15,10.48 R22.1 10.01,6.63 14.35,2.29 17.75,2.29 17.78,2.31 | C24.2 10.03,10.6 10.15,10.48 | 17.78,2.31 17.8,2.34 16.15,2.34 v15.01,3.48 | 17.78,2.31 HUMIDITY.-V | R2.1 8.09,79.18 8.03,79.12 | R2.1 R3.1 | R1.1 8.09,76.11 8.2,76 | R1.1 R2.1 | R1.1 8.09,74.05 v7.85,73.81 | U$1.19 23.43,69.25 23.16,68.99 C32.- 23.16,68.83 23.14,68.81 | 23.14,68.81 21.43,70.52 U$1.18 21.43,70.5 v20.68,69.75 | C31.2 23.52,63.5 23.14,63.88 23.14,68.81 | 58.05,63.98 58.06,63.96 | C34.- 58.05,63.98 | 58.05,63.98 57.91,64.11 C33.2 57.91,66.83 57.89,66.85 58.16,67.13 IC1.5 | 36.59,30.93 36.58,30.94 36.75,31.11 EXT_BOARD.2 | 36.59,30.93 EXT_BOARD.4 | 36.59,30.93 35.37,30.93 v34.95,30.5 | SD.4 36.75,37.18 | 36.75,37.18 SD.2 36.72,38.9 v36.02,40.46 | 36.75,37.18 36.73,37.16 | WIFI.4 WIFI.2 | WIFI.4 36.75,43.51 36.68,43.43 | WIFI.4 35.01,43.62 v34.44,43.05 | U$5.1 19.64,33.85 19.61,33.88 19.64,33.92 U$5.2 19.64,34.53 v18.06,32.94 | v83.84,79.27 83.5,78.93 C26.2 81.73,78.93 80.41,80.25 IC1.24 | C15.2 36.47,71.77 36.28,71.58 C5.- 35.52,71.58 v34.29,70.36 | 39.27,78.9 39.37,78.99 | 39.27,78.9 16MHZ.4 | C37.2 38.99,78.61 39.27,78.9 | C36.2 43.56,81.41 43.69,81.28 43.51,81.1 16MHZ.2 | U$1.43 15.36,101.21 15.24,101.09 15.12,101.21 | 17.43,101.19 17.53,101.09 | 17.43,101.19 U$1.42 U$1.41 | 17.43,101.19 17.41,101.21 U$1.43 | U$1.41 19.44,101.21 19.56,101.09 | U$1.41 U$1.40 | U$1.40 21.47,101.21 21.59,101.09 | U$1.40 U$1.39
  Top 0.406: U$1.39 23.48,101.21 23.62,101.35 | U$1.39 25.29,101.21 25.4,101.09 25.43,101.12 U$1.38 27.29,101.21 27.43,101.34 | 27.43,101.34 27.43,101.35 | 27.43,101.34 U$1.37 U$1.36 | U$1.36 29.6,101.21 29.72,101.09 | U$1.36 32.4,101.21 v34.29,99.31 | U$1.44 10.78,101.21 v8.38,98.81 | U$1.43 13.58,101.21 13.46,101.09 15.49,101.09 15.43,101.16 U$1.43 | C6.- 47.31,94.68 v48.01,93.98 | 63.79,96.38 C19.2 63.82,96.38 v64.75,97.31 66.16,95.89 IC1.34 66.17,88.45 | C35.2 76.48,99.47 v76.81,99.8 82.4,99.8 84.43,97.77 | IC1.44 58.16,90.41 56.41,92.15 56.41,92.51 v56.62,92.71 | U1.CD2 111.53,81.43 111.58,81.48 115.97,77.1 U1.6 | U1.GND3 124.67,73.11 v123.98,72.42 | U1.GND1 125.67,89.77 v123.47,91.97
  Top 0.61: C13.- 105.08,10.01 105,9.93 | C27.- 105.03,3.81 105,3.83 105.08,3.91 105.08,6.83 | C13.- 105.08,6.83 | MCP1826S.GND 96.52,9.32 97.41,10.21 105.08,10.21 105.13,10.16 | 105.13,10.16 105.23,10.06 | 105.13,10.16 C13.- | C13.- 105.08,10.13 | C13.- | C12.- | C13.- C12.- | 105.08,6.83 | LED5.C 110.49,6.83 105.08,6.83 | C2.2 99.16,34.32 99.16,34.39 104.11,34.39 C1.2 | C22.2 68.45,11.96 69.09,12.6 69.55,12.6 v70.41,13.46
  Bottom 0.203: v83.8,98.37 83.95,98.22
  Bottom 0.254: v32.97,77.55 34.04,77.72 | v37.11,89.59 37.08,89.92 37.34,89.66 | v55.24,79.07 57.66,79.07 58.47,78.26 58.47,76.17 v59.11,75.54
  Bottom 0.305: v112.6,44.42 112.78,44.42 112.83,44.37 | v98.04,56.41 98.04,56.46 97.84,56.67 | v113.41,59.66 113.41,59.82 113.59,59.99 | v52.02,13.74 52.15,13.74 52.22,13.82 | v44.68,76.81 44.68,76.78 44.86,76.61 | v100.43,74.91 100.61,74.91 100.79,75.08 | v106.83,74.88 107.01,74.88 107.11,74.98 | v110.16,84 110.36,84.2
  Bottom 0.406: v91.24,61.21 91.19,61.21 90.93,60.96 | v88.01,42.9 88.19,42.9 88.32,43.03 | v36.27,14.48 36.27,14.43 36.45,14.25 | v15.01,3.48 14.96,3.48 14.68,3.76 | v7.85,73.81 7.34,73.81 7.32,73.84 | v20.68,69.75 20.68,69.6 20.9,69.37 | v34.95,30.5 34.95,30.12 34.98,30.1 | v36.02,40.46 36.04,40.08 36.96,40.26 | v34.44,43.05 34.44,42.85 34.54,42.75 | v18.06,32.94 18.01,32.94 17.83,33.12 | v83.84,79.27 83.9,79.27 84,79.17 | v34.29,70.36 34.8,69.85 | v34.29,99.31 35.05,99.31 | v8.38,98.81 8.64,98.55 | v48.01,93.98 48.26,93.98 48.51,93.73 | v64.75,97.31 65.33,97.31 65.41,97.23 | v76.81,99.8 77.04,99.8 77.14,99.69 | v56.62,92.71 56.69,92.71 56.77,92.63 | v123.98,72.42 123.62,72.42 | v123.47,91.97 123.55,91.97 123.7,92.13
  Bottom 0.61: v70.41,13.46 70.21,13.26
  pour Bottom: 0,101.6 127,101.6 127,0 0,0
HUMIDITY  (via drill 0.6)
  Top 0.406: 16.14,10.48 R22.2 | 16.14,10.48 19.02,7.59 19.02,2.34 19.07,2.29 | 19.07,2.29 19.1,2.26 | HUMIDITY.OUT 19.07,2.29 | 16.14,10.48 16.08,10.41 v16.08,7.9 | 55.78,72.86 55.78,73.05 | 55.78,72.86 IC1.2 | v55.14,71.42 55.78,72.06 55.78,72.86
  Bottom 0.406: v16.08,7.9 19.3,4.67 23.01,4.67 23.01,6.43 15.47,13.97 15.47,14.99 34.27,33.78 34.27,38.53 31.85,40.95 21.57,40.95 20.65,41.86 20.65,52.58 39.17,71.17 54.86,71.17 55.12,71.42 v55.14,71.42
LEFT  (via drill 0.6)
  Top 0.406: IC1.50 47.68,85.84 v42.04,91.49 | U$5.7 19.61,39.8 19.56,39.75 18.9,40.41 v16.18,40.41
  Bottom 0.406: v42.04,91.49 19.1,91.49 19.02,91.42 18.87,91.42 18.31,90.86 18.31,90.83 16.38,88.9 16.38,40.62 v16.18,40.41
LIGHT_SCL  (via drill 0.6)
  Top 0.254: LIGHT.A1 57.62,7.8 56.97,8.41 | R24.1 52.84,7.94 52.81,7.98 52.91,8.41 56.97,8.41 | 56.97,8.41 55.96,9.47 v55.96,9.73 | IC1.17 72.69,70.71 v72.69,62.76
  Bottom 0.254: v55.96,9.73 55.96,24.59 69.42,38.05 69.42,55.47 71.12,57.17 71.12,61.19 v72.69,62.76
LIGHT_SDA  (via drill 0.6)
  Top 0.254: R23.1 53.57,5.08 55.45,6.96 56.69,6.96 LIGHT.B1 55.37,6.96 v54.99,7.34 | v70.97,62.71 67.36,66.32 67.36,70.48 67.39,70.51 67.39,71.12 66.95,71.55 IC1.16
  Bottom 0.254: v54.99,7.34 54.99,24.82 68.63,38.46 68.63,60.38 v70.97,62.71
MIC  (via drill 0.6)
  Top 0.406: IC1.63 49.21,75.44 48.72,74.95 48.72,73 v48.97,72.75 | v60.94,7.04 60.94,7.39 61.44,7.9 62.43,7.9 62.4,7.86 MICROPHONE.1
  Bottom 0.406: v48.97,72.75 48.77,72.75 48.51,72.49 38.46,72.49 19.25,53.29 19.25,41.12 20.85,39.52 31.55,39.52 32.92,38.15 32.92,34.47 14.12,15.67 14.12,8.51 18.75,3.89 25.5,3.89 28.07,1.32 54.48,1.32 60.53,7.37 60.6,7.37 v60.94,7.04
MIC_NEG
  Top 0.406: IC1.4 57.36,74.19 56.9,74.65 IC1.64 53.16,74.65 | 53.16,74.65 53.14,74.68 | IC1.64 53.16,74.65
N$1  (via drill 0.6)
  Top 0.406: R17.1 59.69,96.52 ISP.5 | IC1.57 47.26,80.25 v46.71,80.7
  Bottom 0.406: v46.71,80.7 47.9,80.82 48.13,81.18 47.68,82.5 44.45,85.09 44.45,93.98 45.97,95.5 50.29,95.5 51.05,94.74 55.88,94.74 56.39,95.25 56.39,96.27 56.52,96.39 ISP.5
N$2  (via drill 0.6)
  Top 0.406: 53.34,81.03 53.32,81.05 IC1.56 53.1,81.05 53.09,81.03 48.01,81.38 v46.63,82.09
  Bottom 0.406: ISP.1 45.47,96.52 43.18,94.23 43.18,84.58 v46.63,82.09
N$3
  Top 0.406: LED2.A 10.31,88.27 10.85,87.73 25.53,87.73 28.55,84.71 30.79,84.71 30.86,84.63 U$1.28
N$4
  Top 0.406: LED1.A 9.83,90.81 10.9,89.74 25.48,89.74 28.5,86.72 30.96,86.72 | 30.96,86.72 30.95,86.71 U$1.29 | 30.96,86.72 30.99,86.74
N$5
  Top 0.406: LED3.A 25.07,85.72 28.12,82.68 30.58,82.68 30.63,82.63 30.71,82.71 U$1.27
N$6
  Top 0.406: LED1.C 3.76,90.81 2.21,89.26 2.21,78.31 4.12,76.4 4.95,76.4 5.21,76.15 5.25,76.19 R1.2
N$7
  Top 0.406: LED2.C 4.01,88.27 3.25,87.5 3.25,80.52 4.34,79.43 5.41,79.43 5.46,79.38 | 5.46,79.38 5.49,79.35 | 5.46,79.38 R2.2
N$8
  Top 0.406: R3.2 5.25,82.67 5.31,82.73 4.92,83.12 LED3.C
N$10
  Top 0.61: 114.88,29.21 114.91,29.21 | 114.88,29.21 X1.VBUS | 114.88,29.21 110.07,29.21 FER.1 107.48,31.7 107.47,31.7 107.47,34.95 C1.1
N$12
  Top 0.305: U3.16 114.01,39.81 114.83,38.99 114.83,31.73 | 114.83,31.73 114.84,31.73 X1.D- | 114.83,31.73 114.81,31.7
N$13
  Top 0.305: U3.15 110.64,32.79 112.88,30.43 116.38,30.43 116.84,31.01 116.84,31.67 116.86,31.7 X1.D+
N$14
  Top 0.406: C8.+ 72.54,53.98 69.9,56.62 69.9,59.36 69.85,59.31 U$4.19
N$15
  Top 0.406: C8.- 89.23,54.71 88.11,56.29 78.13,56.29 77.57,56.97 77.57,59.26 77.47,59.16 U$4.16
N$16
  Top 0.406: EXT_BOARD.1 39.45,34.23 37.95,35.74 34.92,35.74 33.68,36.98 33.68,37.01 33.48,37.21 33.48,47.04 34.95,48.51 34.95,52.27 33.17,54.05 | 33.17,54.05 | 33.17,54.05 R13.2
N$17
  Top 0.406: EXT_BOARD.3 38.95,30.93 38.1,31.77 38.1,34.16 37.54,34.72 34.67,34.72 32.56,36.83 32.56,49.48 33.25,50.16 | 33.25,50.16 33.27,50.19 | 33.25,50.16 R14.2
N$18
  Top 0.305: U3.17 108.05,40.46 106.73,39.14 106.73,34.65 105.26,33.17 100.71,33.17 100.25,32.72 96.9,32.72 96.39,33.22 96.39,34.39 | 96.39,34.39 C2.1 | 96.39,34.39 96.42,34.42
N$19
  Top 0.305: C17.+ 96.57,67.94 101.4,63.12 101.4,60.1 101.8,59.69 103.33,59.69 103.35,59.72 103.36,59.7 U2.2
N$20
  Top 0.305: X2.3 116.08,58.42 U2.14
N$21
  Top 0.406: C9.+ 77.93,46.99 68.68,56.24 68.68,60.43 69.29,61.04 71.73,61.04 72.42,60.35 72.42,58.93 72.39,58.95 U$4.18
N$22
  Top 0.406: C9.- 89.55,49.14 87.63,51.05 87.63,55.12 87.4,55.35 76.4,55.35 75.03,56.72 75.03,58.85 74.93,58.95 U$4.17
N$23
  Top 0.406: U$4.15 79.99,59 79.98,59 81.94,60.96 C7.+
N$24
  Top 0.406: U$4.27 49.53,59.03 49.36,59.2 R4.1
N$25
  Top 0.305: U$14.8 101.09,81.92 102.06,80.9 104.62,80.9 104.88,81.2 104.88,85.72 106.22,87.07 106.2,87.1 R5.2
N$26
  Top 0.406: SD.1 39.45,40.97 42.39,43.92 42.39,55.27 39.88,57.78 R8.2
N$27
  Top 0.406: R6.2 39.85,50.16 39.93,50.09 39.45,49.61 WIFI.1
N$28
  Top 0.406: WIFI.3 40.68,43.62 41.5,44.45 41.5,52.88 40.54,53.85 39.83,53.85 39.84,53.86 R7.2
N$29
  Top 0.305: U2.13 110.92,57.15 110.97,57.1 114.66,57.1 117.2,54.51 119.63,54.51 120.09,54.94 120.09,56.87 118.44,58.52 118.57,58.65 X2.2
N$30
  Top 0.406: SD.3 38.92,37.27 38.1,38.1 38.1,47.37 38.43,47.7 38.43,55.42 37.9,55.96 33.71,55.96 33.25,56.41 33.25,57.73 33.27,57.76 R9.2
N$31
  Top 0.305: C18.- 100.97,53.98 101.6,54.61 103.28,54.61 103.3,54.59 103.33,54.61 U2.6
N$32
  Top 0.406: C21.1 64.9,13.26 64.85,13.21 64.92,13.13 R10.1
N$33
  Top 0.305: R10.2 60.02,8.89 60.02,5.99 61.32,4.85 62.26,4.85 62.27,4.86 MICROPHONE.2
N$37
  Top 0.61: R12.2 115.65,3.81 115.57,3.89 116.05,4.37 LED5.A
N$41
  Top 0.305: U2.1 103.45,60.96 103.48,60.98 103.17,61.29 C28.+
N$42
  Top 0.305: C28.- 106.38,59.21 105.61,58.45 103.38,58.45 103.36,58.46 | 103.36,58.46 103.25,58.57 | U2.3 103.36,58.46
N$43
  Top 0.305: C29.+ 96.19,61.42 97.54,62.76 100.03,62.76 100.89,61.9 100.89,57.86 101.58,57.17 103.25,57.17 103.33,57.1 103.36,57.14 U2.4
N$49
  Top 0.305: C29.- 99.39,57.2 100.71,55.88 103.56,55.88 | 103.56,55.88 U2.5 | 103.58,55.85 103.56,55.88
N$51
  Top 0.305: U$14.6 99.99,78.98 101.27,77.7 101.27,77.22 101.7,76.78 103.45,76.78 103.4,76.83 R20.2
PRESSURE  (via drill 0.6)
  Top 0.406: PRESSURE.4 23.27,4.45 v21.92,5.79 | IC1.1 54.25,72.84 v53.62,72.21
  Bottom 0.406: v21.92,5.79 21.92,6.53 14.73,13.77 14.73,15.29 33.55,34.01 33.55,38.38 31.67,40.26 21.16,40.28 19.96,41.25 19.96,52.91 38.84,71.78 53.39,71.78 53.62,72.01 v53.62,72.21
RIGHT  (via drill 0.6)
  Top 0.406: IC1.51 46.53,85.05 v41.99,89.59 | U$5.6 19.64,38.12 19.53,38.23 v18.21,38.23
  Bottom 0.406: v41.99,89.59 41.91,89.59 40.79,90.7 20.14,90.7 | 20.14,90.7 20.07,90.78 | 20.14,90.7 19.48,90.7 17.37,88.59 17.37,39.06 v18.21,38.23
RTC_SCL  (via drill 0.6)
  Top 0.203: 71.93,99.26 R16.1 | 71.93,99.26 70.71,98.04 67.77,98.04 v67.11,97.38 | 63.73,88.41 63.73,88.37 | IC1.37 63.73,88.41 | v62.71,93.88 63.73,92.86 63.73,88.41 | 71.93,99.26 73.08,98.12 75.89,98.12 77.62,96.39 80.24,96.39 | 81.89,96.39 U$2.3 80.24,96.39 | 80.24,96.39 80.24,96.37 v79.83,95.96
  Bottom 0.203: v67.11,97.38 67.11,93.5 66.6,92.99 63.6,92.99 v62.71,93.88 | X3.4 96.52,95.81 95.35,96.98 95.35,98.83 94.84,99.34 83.31,99.34 82.91,98.93 82.91,96.75 82.58,96.42 80.29,96.42 v79.83,95.96
RTC_SDA  (via drill 0.6)
  Top 0.203: R15.1 69.11,99.39 v66.5,99.16 | IC1.36 64.57,88.39 | IC1.36 | v64.08,93.88 64.57,93.4 IC1.36 | v78.03,97.21 78.44,96.79 U$2.2 82.37,96.79 82.42,96.85 | v81.86,98.4 82.45,98.4 82.78,98.22 82.78,97.1 82.42,96.85 | 82.42,96.85 82.37,96.8
  Bottom 0.203: v64.08,93.88 64.49,93.47 66.34,93.47 66.55,93.67 66.55,96.67 66.02,97.21 66.02,98.58 v66.5,99.16 66.47,99.19 | v78.03,97.21 69.24,97.21 67.18,99.19 66.47,99.19 | 66.47,99.19 66.5,99.19 | X3.3 96.52,98.96 95.73,99.75 82.14,99.75 81.28,98.88 81.28,98.5 81.76,98.5 v81.86,98.4
SD2_CD  (via drill 0.6)
  Top 0.203: v89.71,93.29 89.59,93.29 88.21,94.67 83.06,94.67 82.73,94.67 81.84,95.56 U$2.5
  Top 0.254: IC1.47 55.76,85.94 v55.09,85.27 | v73.25,89.08 73.25,93.29 v73.36,93.4 | v83.06,94.26 83.06,94.67
  Bottom 0.203: X3.13 109.09,97.79 107.87,96.57 107.87,94.41 106.22,92.76 90.25,92.76 v89.71,93.29
  Bottom 0.254: v55.09,85.27 59.28,85.27 60.58,83.97 68.15,83.97 v73.25,89.08 | v73.36,93.4 82.19,93.4 v83.06,94.26
SD2_CLK  (via drill 0.6)
  Top 0.203: 89.36,94.97 89.18,95.15 | v89.53,94.79 89.36,94.97 | U$2.6 88.73,95.59 89.36,94.97 | IC1.43 58.96,90.39 58.95,90.42 58.19,91.82 v57.86,92.3
  Bottom 0.203: X3.12 106.68,95.17 104.72,93.17 91.11,93.17 v89.53,94.79 87.02,94.79 83.24,91.01 61.24,91.01 60.33,90.09 59.31,90.09 58.83,90.58 58.12,91.95 57.96,92.15 v57.86,92.3
SD2_CS  (via drill 0.6)
  Top 0.203: 85.27,96.79 U$2.9 | 85.27,96.79 93.38,96.79 93.5,96.67 99.75,96.67 100.13,97.21 100.13,99.08 101.09,99.9 102.82,99.9 X3.9 104.17,97.77 | IC1.40 61.36,92.16 v60.48,93.83 | v86,97.66 85.27,97.16 85.27,96.79
  Bottom 0.203: v60.48,93.83 61.21,92.43 82.53,92.43 85.27,95.17 85.27,97.18 v86,97.66
SD2_MISO  (via drill 0.6)
  Top 0.203: v91.34,94.31 91.16,94.31 90.04,95.43 | 90.04,95.43 89.86,95.61 | U$2.7 89.48,95.99 90.04,95.43 | IC1.42 59.76,90.56 59.74,90.58 58.8,92.76 57.91,93.65 v57.53,93.65
  Bottom 0.203: X3.11 106.68,97.54 105.39,96.24 105.39,94.59 104.34,93.55 92.1,93.57 v91.34,94.31 91.34,94.34 89.81,95.86 86.59,95.86 86.16,95.43 86.16,94.64 83.01,91.49 61.01,91.49 60.25,90.73 59.84,90.73 58.88,91.69 58.88,92.69 57.91,93.65 v57.53,93.65
SD2_MOSI  (via drill 0.6)
  Top 0.203: v91.21,95.78 90.75,96.22 90.6,96.39 U$2.8 | IC1.41 60.56,92.12 v59.18,93.75
  Bottom 0.203: X3.10 103.61,95.25 102.41,94.06 92.81,94.06 v91.21,95.78 91.24,95.78 | v59.18,93.75 59.74,91.97 62.59,91.95 82.7,91.95 85.75,95 85.75,95.73 86.44,96.42 90.6,96.42 91.24,95.78 | 91.24,95.78 91.29,95.73
SD_CD  (via drill 0.6)
  Top 0.254: IC1.46 56.56,89.31 v55.78,90.09 | v69.27,90.22 70.69,90.22 v73.33,87.58 | 111.53,75.67 111.58,75.62 | 111.53,75.67 U1.CD1 | v109.14,76.25 110.95,76.25 111.53,75.67
  Bottom 0.254: v55.78,90.09 58.19,90.09 58.78,89.51 68.66,89.59 v69.27,90.22 | v73.33,87.58 74.68,87.58 78.54,83.72 78.54,82.88 84.73,76.68 108.71,76.68 v109.14,76.25
SD_CLK  (via drill 0.6)
  Top 0.254: U1.5 120.2,78.2 116.99,81.41 116.99,85.5 v113.69,88.8 | v85.62,88.77 83.87,88.77 v82.37,90.22 | v65.63,85.85 66.95,87.63 66.95,88.32 IC1.33
  Bottom 0.254: v113.69,88.8 85.65,88.8 v85.62,88.77 | v82.37,90.22 70.54,90.27 v65.63,85.85
SD_CS  (via drill 0.6)
  Top 0.254: U1.2 119.9,81.5 118.75,82.65 118.75,87.99 v115.44,91.29 | v80.42,86.67 75.97,86.67 74.35,85.04 69.27,85.04 69.22,84.99 69.16,85.05 IC1.30
  Bottom 0.254: v115.44,91.29 85.04,91.29 v80.42,86.67
SD_GREEN  (via drill 0.6)
  Top 0.254: R9.1 30.39,59.32 v31.39,60.33 | 62.13,72.95 62.16,72.92 IC1.10 | v61.87,71.2 62.13,72.95 | 62.13,72.95 62,73.08
  Bottom 0.254: v31.39,60.33 31.39,61.47 39.78,69.85 57.43,69.85 58.47,70.89 61.7,70.89 v61.87,71.2
SD_MISO  (via drill 0.6)
  Top 0.254: IC1.32 73.64,86.64 75.79,88.8 82.42,88.8 v84.05,87.17 | v117.5,90.96 122.25,90.96 124.13,89.08 124.13,77.11 123.01,76 121.61,76 | 121.61,76 121.62,76 U1.7 | 121.61,76 121.56,75.95
  Bottom 0.254: v84.05,87.17 85.95,87.17 86.72,87.94 111.68,87.94 111.84,87.78 114.33,87.78 v117.5,90.96
SD_MOSI  (via drill 0.6)
  Top 0.254: U1.3 119.98,80.4 118.01,82.37 118.01,86.67 v114.71,89.97 | v82.19,87.07 81.66,87.07 80.87,87.86 75.95,87.86 73.94,85.85 68.53,85.85 68.52,85.84 | 68.52,85.84 68.48,85.8 | 68.52,85.84 IC1.31
  Bottom 0.254: v114.71,89.97 85.09,89.97 v82.19,87.07
SD_RED  (via drill 0.6)
  Top 0.254: R8.1 36.99,58.61 v36.14,59.46 | 62.96,72.87 62.97,72.87 | 62.96,72.87 IC1.11 | v62.71,68.63 62.89,72.8 62.96,72.87
  Bottom 0.254: v36.14,59.46 36.14,62.28 40.87,67 61.27,67 v62.71,68.63
SELECT  (via drill 0.6)
  Top 0.254: v35.13,83.39 38.89,83.39 39.75,84.25 44.63,84.25 45.82,83.06 51.79,83.06 52.27,82.58 53.03,82.58 53.1,82.64 IC1.54
  Top 0.406: U$5.5 30.45,37.9 v31.39,37.9
  Bottom 0.406: v31.39,37.9 31.32,37.82 20.34,37.82 18.21,39.95 18.21,88.09 19.96,89.84 28.68,89.84 v35.13,83.39
SYNC  (via drill 0.6)
  Top 0.254: IC1.9 61.36,72.18 60.58,71.4 60.58,69.67 61.62,68.63 62.18,67.23 62.18,61.82 63.42,60.58 63.42,54.86 v70.33,47.95 | LIGHT.A2 58.52,6.35 58.73,6.55 58.73,8.97 v57.33,10.36
  Bottom 0.254: v57.33,10.36 56.79,10.9 56.79,24.13 70.31,37.64 70.31,47.57 70.33,47.57 v70.33,47.95
TEMP  (via drill 0.6)
  Top 0.406: TEMPERATURE.2 68.9,6.34 v67.64,5.08 | IC1.3 56.56,71.3 v57.02,70.84
  Bottom 0.406: v67.64,5.08 64.87,5.08 61.49,8.46 60.6,8.46 54.25,2.11 28.35,2.11 16.15,14.3 16.15,14.66 34.9,33.4 34.9,38.81 32.08,41.63 21.69,41.63 21.34,41.99 21.34,52.27 39.42,70.48 56.59,70.43 57,70.84 v57.02,70.84
THERMISTOR_(0-50C)
  Top 0.203: R5.1 103.43,87.15 102.89,87.68 102.89,98.48 102.26,99.11 100.97,99.11 100.51,98.65 100.51,96.27 99.49,95.25 X3.6 98.45,95.25 97.1,93.9 97.1,93.27 95.99,92.15 83.46,92.15 80.86,94.75 | 80.86,94.75 80.82,94.79 | U$2.4 81.08,95.99 80.82,95.73 80.82,94.82 80.87,94.77 80.86,94.75
  Top 0.305: 103.43,81.97 103.45,81.94 | 103.43,81.97 R11.2 | R5.1 103.35,82.04 103.43,81.97
UP  (via drill 0.6)
  Top 0.406: IC1.48 48.72,88.44 v42.16,95 | U$5.3 28.57,35.51 28.63,35.56 28.98,35.2 v30.43,35.2
  Bottom 0.406: v42.16,95 42.14,95 40.44,93.29 18.36,93.29 14.58,89.51 14.58,41.88 13.74,41.05 13.74,39.42 17.32,35.84 29.79,35.84 v30.43,35.2
V+
  Top 0.305: C13.+ 106.66,11.79 106.66,18.9 104.42,21.13 104.42,21.44 104.39,21.44 D1.1
  Top 0.61: MCP1826S.IN 93.98,13.08 102.31,21.41 104.19,21.41 104.24,21.46 D1.1 104.37,26.24 104.32,26.29 104.37,26.34 D2.1
V_IN
  Top 0.61: C12.+ 108.15,16.51 | C12.+ J1.PWR | C12.+ 108.36,16.51 108.79,16.94 D1.2
V_USB
  Top 0.61: FER.2 105.84,31.74 105.84,29.77 108.89,26.72 108.89,26.49 108.86,26.49 D2.2
VBAT
  Top 0.305: 101.47,82.7 101.47,82.65 101.21,82.92 U$14.10 | 101.47,82.7 101.47,82.73 | 101.47,82.7 101.52,82.7 101.24,82.42 U$14.9
  Top 0.61: X3.8 101.6,95.22 | X3.8 X3.7 | X3.8 101.6,82.86 101.47,82.73
VCC  (via drill 0.6)
  Top 0.203: 79.83,97.48 80.12,97.19 U$2.1 81.34,97.19 v80.59,97.94
  Top 0.254: LIGHT.B2 55.88,6.35 55.52,5.84 55.52,3.76 54.51,2.62 50.55,2.64 50.01,3.17 50.01,5.16 | 50.01,5.16 | 50.01,5.16 R23.2 50.01,7.9 49.97,7.94 | 50.01,5.16 49.94,5.23 | 49.97,7.94 49.96,7.95 | 49.97,7.94 R24.2 50.01,10.74 50.04,10.77 50.03,10.77 C25.1 | C16.1 44.58,84.96 45.97,83.57 52.83,83.57 53.09,83.31 53.16,83.39 IC1.53 | 50.6,66.7 50.6,66.67 50.01,66.67 R4.2 | C14.1 66.67,63.19 66.67,70.87 66.14,71.4 66.14,72.86 | 66.14,72.86 66.14,72.92 | IC1.15 66.14,72.86
  Top 0.305: 107.53,42.41 U3.20 | 104.93,45.01 104.83,45.11 | 104.93,45.01 107.52,42.42 | 104.93,45.01 104.28,45.66 U3.4 102.86,45.66 | 96.39,40.57 96.42,40.54 | 96.39,40.57 C4.1 | 96.39,40.57 96.19,40.77 C3.+ 96.19,47.12 97.64,48.56 100.41,48.56 100.89,48.13 100.89,45.97 101.17,45.64 102.84,45.64 102.86,45.66 | 102.86,45.66 102.87,45.67 | U2.16 110,61.07 109.96,61.11 110.16,61.32 C30.+ | IC1.45 57.36,84.84 56.34,83.46 | IC1.53 55.96,83.44 56.34,83.46 | 56.59,78.89 56.44,78.79 54.29,77.05 IC1.61 46.77,77.05 44.45,74.73 40.64,74.73 40.53,74.61 C15.1 | 56.59,78.89 56.59,83.31 56.34,83.46 | IC1.62 54.53,76.25 56.59,78 56.59,78.89 | 56.59,78.89 56.59,78.92
  Top 0.406: 107.53,42.41 107.52,42.42 107.26,42.67 107.26,60.12 108.1,60.96 U2.16 110.21,60.96 111,61.75 v111,62.15 | 86.41,34.27 86.44,34.24 | 86.41,34.27 C10.1 | C11.+ 86.35,34.33 86.41,34.27 | C25.1 50.03,14.47 52.27,16.71 | 52.27,16.71 69.27,16.71 71.93,14.05 71.93,12.95 71.27,12.29 71.27,9.93 71.3,9.91 71.25,9.86 C22.1 71.31,9.84 71.4,9.93 73.58,7.75 73.58,4.78 71.96,3.15 63.98,3.15 63.5,3.63 63.5,6.35 64.61,7.46 MICROPHONE.4 | 30.66,15.67 30.35,15.36 C23.1 30.35,8.12 29.18,6.96 26.85,6.96 26.84,6.95 | 30.66,15.67 32.38,17.4 51.56,17.4 52.27,16.69 52.27,16.71 | 26.84,6.95 26.8,6.91 | 26.84,6.95 PRESSURE.2 | 30.66,15.67 30.54,15.56 30.33,15.56 C24.1 12.83,15.68 12.88,15.72 16.38,12.22 16.38,12.19 20.32,8.26 HUMIDITY.V+ | C32.+ 26.36,68.83 26.34,68.81 25.43,69.72 U$1.20 | 26.36,68.81 | C32.+ 26.36,68.81 | U$1.21 27.43,69.87 26.49,68.94 | 26.49,68.94 26.36,68.81 | C31.1 26.01,63.35 | C31.1 | 26.34,63.68 C31.1 | 26.34,63.68 26.34,19.51 30.33,15.52 | 26.49,68.94 26.45,68.9 C32.+ | 26.34,63.68 26.34,68.78 26.49,68.94 | C34.+ 54.76,66.31 55.19,66.75 C33.1 55.12,66.75 55.07,66.7 50.6,66.7 50.52,66.7 47.95,69.27 47.95,75.29 48.91,76.25 IC1.62 | C26.1 80.79,81.73 80.11,81.05 68.61,81.05 | 68.61,81.05 IC1.25 | C32.+ 26.23,68.9 26.16,68.83 30.48,68.83 33.02,71.37 33.02,72.9 34.91,74.78 C5.+ 40.53,74.78 40.64,74.68 40.53,74.57 C15.1 40.49,74.57 40.39,74.68 | 59.69,99.06 59.44,98.81 | R17.2 59.69,99.06 | 59.69,99.06 59.81,99.18 C19.1 | R17.2 59.69,99.57 | 56.55,94.14 55.27,95.43 55.27,97.48 55.5,97.71 59.44,97.71 59.74,98.02 59.74,99.44 | 59.74,99.44 59.69,99.39 R17.2 | 59.74,99.44 59.82,99.52
  Top 0.406: 56.55,94.14 57.33,94.89 64.69,94.89 65.33,94.26 65.33,88.44 IC1.35 65.36,87.56 64.31,86.51 64.31,84.48 65.73,83.06 65.81,83.06 | 69.22,96.62 R15.2 | 69.22,96.62 R16.2 71.95,96.62 74.65,96.62 | C19.1 62.15,99.19 | 74.72,96.62 74.78,96.62 | 74.72,96.62 C35.1 74.65,96.64 74.65,96.62 | 74.65,96.62 74.72,96.62 | 69.22,96.62 67.87,95.28 67.87,87.45 67.54,87.12 67.54,86.16 65.81,84.43 65.81,83.06 | 79.83,97.48 78.72,98.6 v77.57,98.6 | v76.5,96.09 75.97,96.62 74.65,96.62 | 56.55,94.14 55.68,93.27 55.68,91.95 57.4,90.22 57.4,88.47 57.38,88.47 IC1.45 | 65.81,81.03 65.81,75.16 66.17,74.8 66.17,73.03 66.16,73.02 IC1.15 | 65.81,83.06 65.81,81.03 | 65.81,81.03 65.86,81.03 65.89,81.05 68.61,81.05 | C19.1 62.13,99.19 | v64.08,99.21 64.06,99.19 C19.1 | C6.+ 47.3,99.39 | C6.+ | ISP.2 51.1,99.39 C6.+ | U1.4 120.5,79.3 v120.37,79.43
  Top 0.61: C27.+ 108.28,2.67 107.44,1.83 101.09,1.83 99.42,3.5 | MCP1826S.OUT 99.06,7.67 99.42,7.32 99.42,3.5 | C27.+ 108.25,3.81 | C27.+ R12.1 | 86.41,34.27 86.41,9.76 86.7,9.46 | 86.7,9.46 93.34,2.82 98.73,2.82 99.42,3.5 | 62.18,58.98 62.2,59 U$4.22 | 62.18,58.98 62.31,58.85 62.31,53.87 75.86,40.32 C11.+ 86.35,43.22 87.38,44.25 93.62,44.25 96.29,46.91 96.22,46.99 C3.+ | U$4.23 59.63,59 59.61,58.98 62.18,58.98 | 86.7,9.46 86.72,9.47 86.35,9.84 C22.1 71.25,7.83 70.89,7.47 70.86,7.5 TEMPERATURE.1 | 30.33,15.56 30.33,15.52
  Bottom 0.406: v77.57,98.6 78.72,98.6 79.3,98.02 79.3,96.75 77.98,95.43 77.17,95.43 v76.5,96.09 | v80.59,97.94 80.59,99.14 81.81,100.36 96.52,100.36 99.06,97.81 X3.5 | v64.08,99.21 61.47,99.21 59.99,97.74 52.88,97.74 52.76,97.87 52.73,97.87 51.54,99.06 ISP.2 | v120.37,79.43 120.37,73.81 115.72,69.16 115.72,65.05 114.43,63.75 112.6,63.75 v111,62.15
VIN
  Top 0.305: C20.+ 94.79,76.83 93.47,78.16 93.47,82.02 93.7,82.25 | 93.7,82.25 94.21,82.75 | 94.21,82.75 94.31,82.86 | U$14.1 94.37,82.92 94.21,82.75 | U$14.2 93.87,82.42 93.7,82.25
WIFI_GREEN  (via drill 0.6)
  Top 0.254: R7.1 35.89,53.98 v35.15,54.71 | v59.54,68.17 59.38,68.17 58.93,68.66 58.93,72.69 58.98,72.75 58.96,72.76 IC1.6
  Bottom 0.254: v35.15,54.71 35.15,62.05 40.66,67.56 58.75,67.56 v59.54,68.17
WIFI_RED  (via drill 0.6)
  Top 0.254: R6.1 36.99,51.12 v36.02,52.09 | v60.81,67.87 60.5,68.63 59.74,69.39 59.74,72.67 59.69,72.72 59.76,72.79 IC1.7
  Bottom 0.254: v36.02,52.09 35.97,52.09 33.93,54.13 33.93,61.65 40.44,68.15 58.22,68.17 59.26,69.24 59.97,69.24 60.5,68.71 v60.81,67.87
WIFI_RX  (via drill 0.6)
  Top 0.203: IC1.38 63.02,88.39 | IC1.38 | IC1.38 62.94,88.47
  Top 0.254: U$1.13 10.74,74.71 v10.03,75.41
  Top 0.406: v42.06,96.8 42.22,96.8 v48.51,90.5 | 62.97,88.45 62.97,88.52 | 62.97,88.45 IC1.38 | v62.48,85.7 62.97,86.18 62.97,88.45
  Bottom 0.406: v10.03,75.41 12.47,75.41 13.82,76.76 13.82,90.02 18.06,94.26 39.52,94.26 v42.06,96.8 | v48.51,90.5 51.26,90.5 55.35,86.41 59.69,86.41 60.96,85.14 61.92,85.14 v62.48,85.7
WIFI_TX  (via drill 0.6)
  Top 0.406: U$1.12 10.67,76.71 v10.03,77.34 | v42.01,98.68 42.01,98.5 48.74,91.77 v49.78,91.77 | v61.06,86.46 61.77,86.46 62.15,86.84 62.15,88.39 62.2,88.44 IC1.39
  Bottom 0.406: v10.03,77.34 12.47,77.34 13.16,78.03 13.16,90.4 17.8,95.05 38.38,95.05 v42.01,98.68 | v49.78,91.77 51.03,91.77 55.65,87.15 60.38,87.15 v61.06,86.46
X1
  Top 0.406: 40.96,78.93 40.89,78.99 | 40.96,78.93 16MHZ.1 | 40.96,78.93 41.28,78.61 C36.1 43.5,78.68 | 43.5,78.68 43.43,78.74 | IC1.59 43.53,78.64 43.5,78.68
X2
  Top 0.406: IC1.58 46.28,79.44 45.47,80.26 45.47,82.55 44.7,83.31 39.88,83.31 39.37,82.8 39.37,81.03 39.3,81.1 16MHZ.3 36.76,81.1 36.32,81.53 36.2,81.41 C37.1

### Text on the board
Dimension: Base Station V1 | Joshua Schapiro | July 30, 2010